# EAGLE design OSSIBeaconNewNew (EAGLE 6.1)

## Sheet 1 of 4
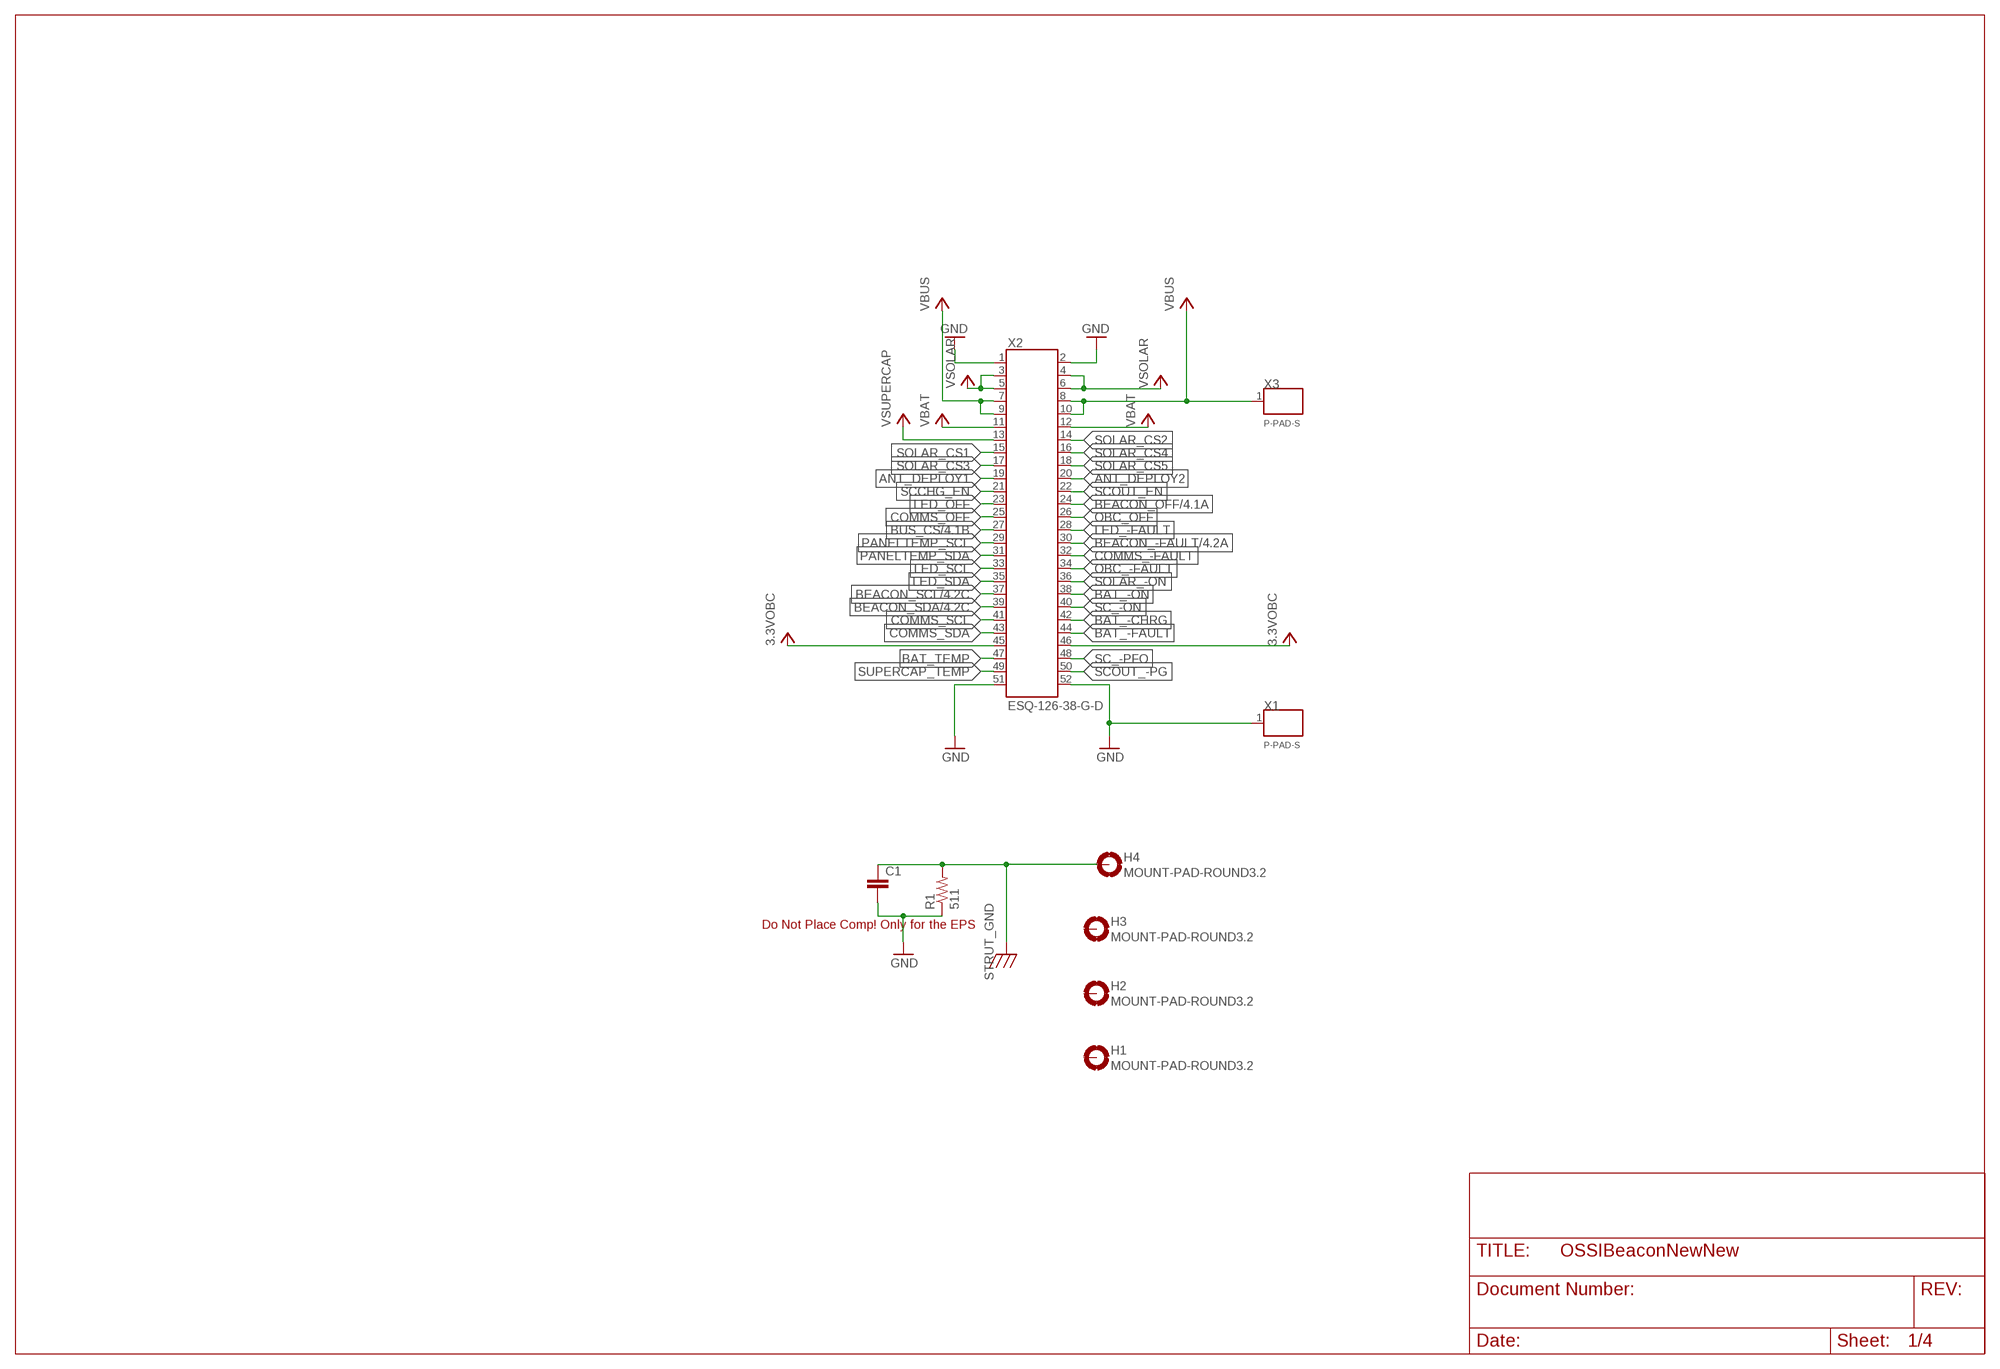
[diagram p0: schematic, sheet 1]

### Parts
C1  C0805(2012)  [C0805(2012)]
H1  MOUNT-PAD-ROUND3.2  [3.2-PAD-ROUND]
H2  MOUNT-PAD-ROUND3.2  [3.2-PAD-ROUND]
H3  MOUNT-PAD-ROUND3.2  [3.2-PAD-ROUND]
H4  MOUNT-PAD-ROUND3.2  [3.2-PAD-ROUND]
R1  511  RWSL1206  [WSL1206]
X1  P-PAD-S  [P-PAD-S]
X2  ESQ-126-38-G-D  [ESQ-126-XX-X-D]
X3  P-PAD-S  [P-PAD-S]

### Nets
3.3VOBC: X2.45 X2.46
ANT_DEPLOY1: X2.19
ANT_DEPLOY2: X2.20
BAT_-CHRG: X2.42
BAT_-FAULT: X2.44
BAT_-ON: X2.38
BAT_TEMP: X2.47
BEACON_-FAULT: X2.30 ; also sheet 4
BEACON_OFF: X2.24 ; also sheet 4
BEACON_SCL: X2.37 ; also sheet 4
BEACON_SDA: X2.39 ; also sheet 4
BUS_CS: X2.27 ; also sheet 4
COMMS_-FAULT: X2.32
COMMS_OFF: X2.25
COMMS_SCL: X2.41
COMMS_SDA: X2.43
GND: C1.2 R1.P$1 X1.1 X2.1 X2.2 X2.51 X2.52 ; also sheet 2,3,4
LED_-FAULT: X2.28
LED_OFF: X2.23
LED_SCL: X2.33
LED_SDA: X2.35
OBC_-FAULT: X2.34
OBC_OFF: X2.26
PANELTEMP_SCL: X2.29
PANELTEMP_SDA: X2.31
SC_-ON: X2.40
SC_-PFO: X2.48
SCCHG_EN: X2.21
SCOUT_-PG: X2.50
SCOUT_EN: X2.22
SOLAR_-ON: X2.36
SOLAR_CS1: X2.15
SOLAR_CS2: X2.14
SOLAR_CS3: X2.17
SOLAR_CS4: X2.16
SOLAR_CS5: X2.18
STRUT_GND: C1.1 H4.B3,2(MOUNT) R1.P$2
SUPERCAP_TEMP: X2.49
VBAT: X2.11 X2.12
VBUS: X2.7 X2.8 X2.9 X2.10 X3.1 ; also sheet 2,4
VSOLAR: X2.3 X2.4 X2.5 X2.6
VSUPERCAP: X2.13
Unconnected: H1.B3,2(MOUNT) H2.B3,2(MOUNT) H3.B3,2(MOUNT)

### Notes on the sheet
- Do Not Place Comp! Only for the EPS

## Sheet 2 of 4
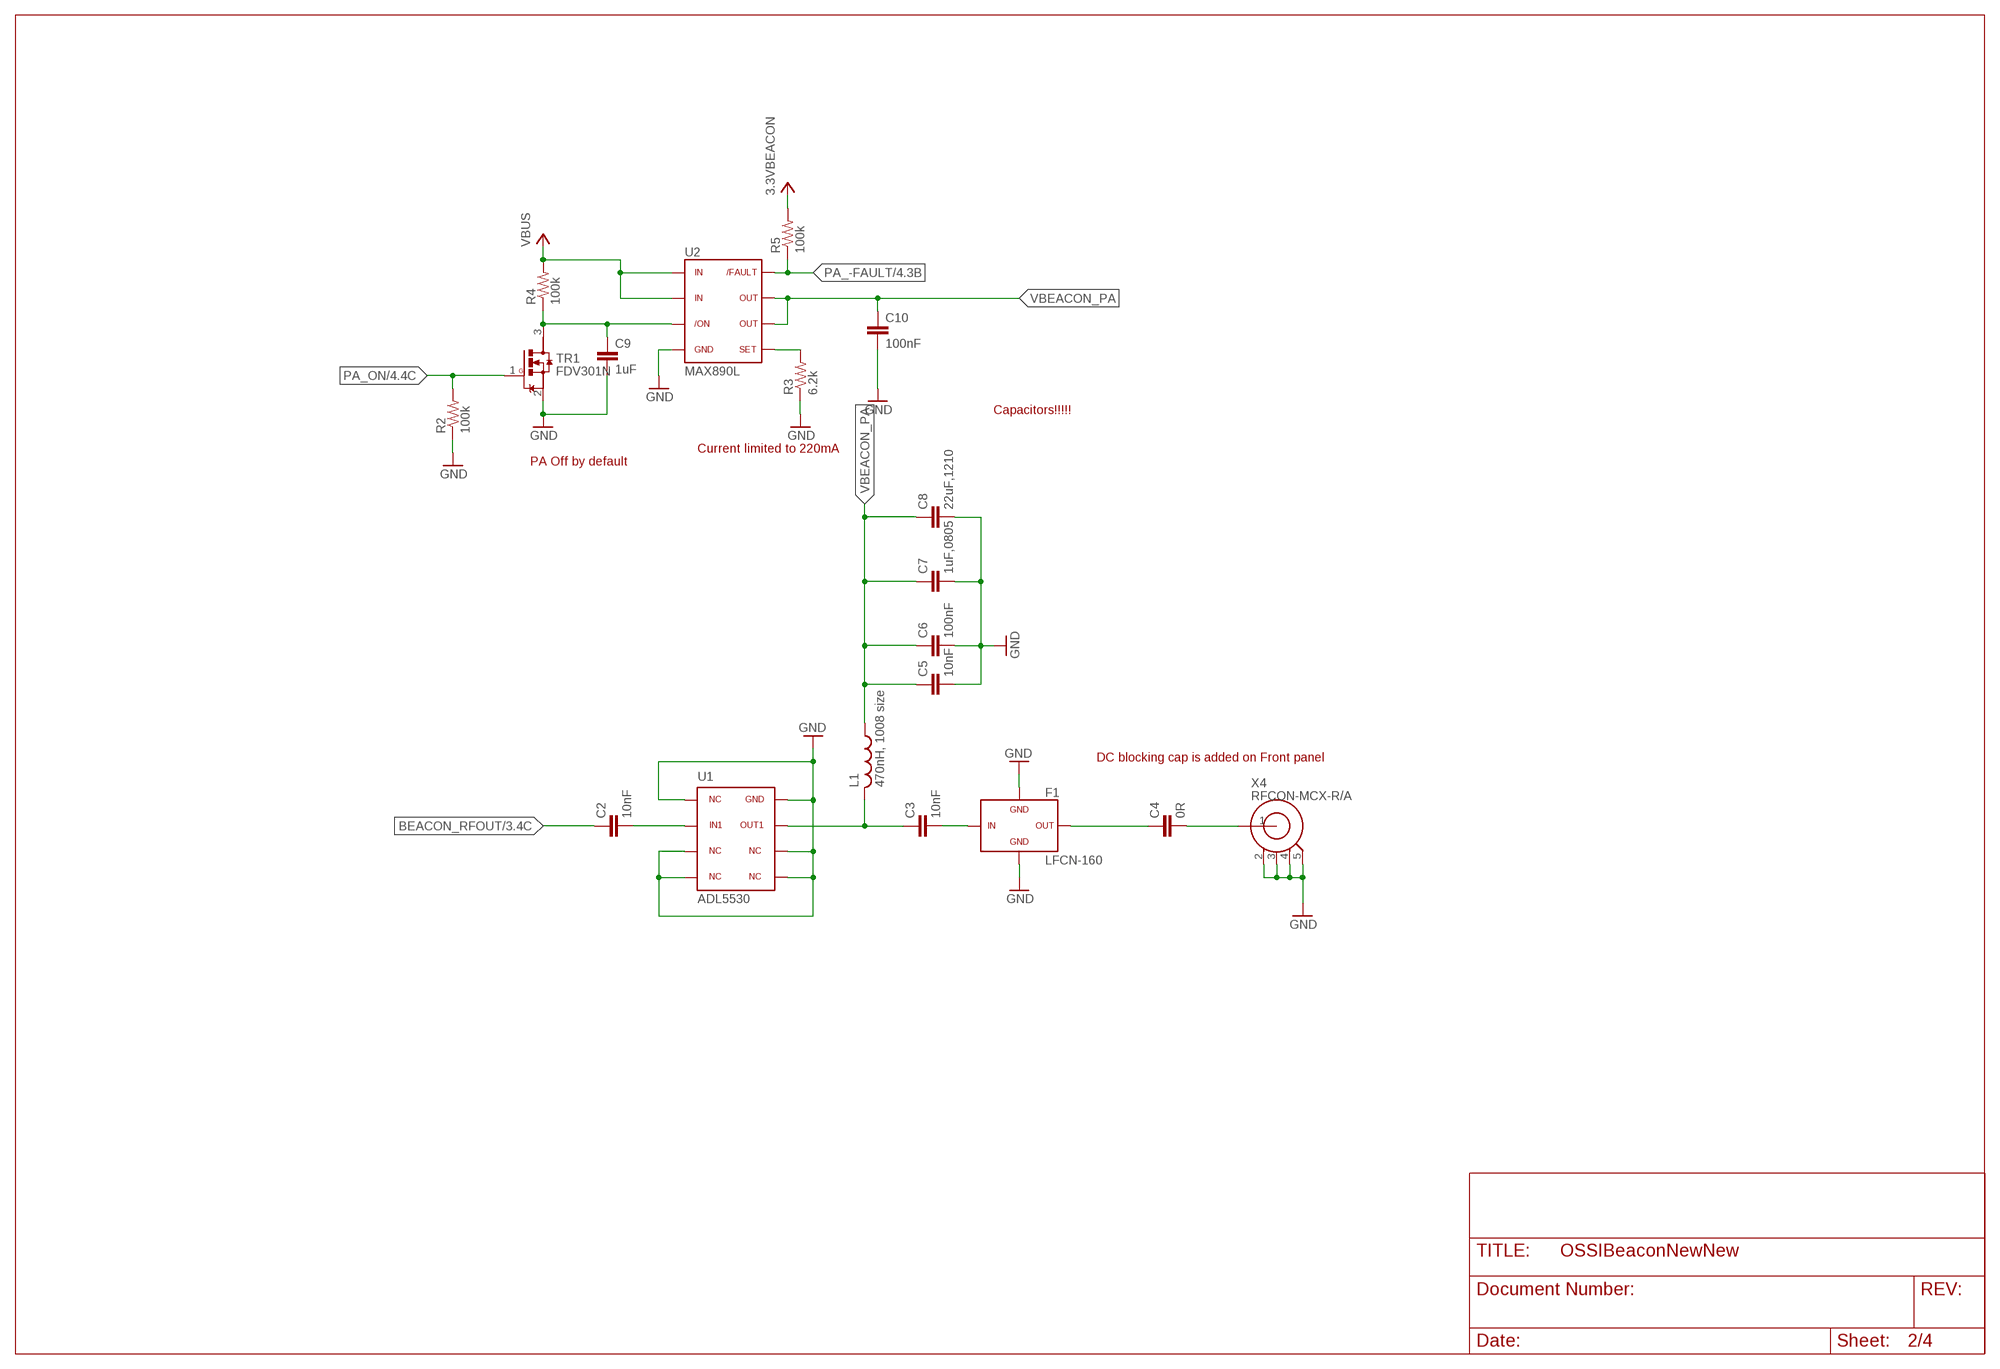
[diagram p1: schematic, sheet 2]

### Parts
C2  10nF  C0603(1608)  [C0603(1608)]
C3  10nF  C0603(1608)  [C0603(1608)]
C4  0R  C0603(1608)  [C0603(1608)]
C5  10nF  C0603(1608)  [C0603(1608)]
C6  100nF  C0603(1608)  [C0603(1608)]
C7  1uF,0805  C0805(2012)  [C0805(2012)]
C8  22uF,1210  C1210(3225)-GCM32  [C1210-GCM32]
C9  1uF  C0603(1608)  [C0603(1608)]
C10  100nF  C0603(1608)  [C0603(1608)]
F1  LFCN-160  [LFCN]
L1  470nH, 1008 size  L1008(2502)  [L1008(2520)]
R2  100k  R0603(1608)  [R0603(1608)]
R3  6.2k  R0603(1608)  [R0603(1608)]
R4  100k  R0603(1608)  [R0603(1608)]
R5  100k  R0603(1608)  [R0603(1608)]
TR1  FDV301N  [SOT23]
U1  ADL5530  [LFCSP8_CP]
U2  MAX890L  [SO8]
X4  RFCON-MCX-R/A  [MCX-R/A]

### Nets
3.3VBEACON: R5.2 ; also sheet 4
BEACON_RFOUT: C2.1 ; also sheet 3
GND: C5.2 C6.2 C7.2 C8.P$2 C9.2 C10.2 F1.2 F1.4 R2.1 R3.1 TR1.2(S) U1.1 U1.3 U1.4 U1.5 U1.6 U1.8 U2.4 X4.2 X4.3 X4.4 X4.5 ; also sheet 1,3,4
N$19: C9.1 R4.1 TR1.3(D) U2.3
N$21: R3.2 U2.5
N$28: C2.2 U1.2
N$30: C3.1 L1.P$2 U1.7
N$34: C3.2 F1.1
N$35: C4.1 F1.3
N$37: C4.2 X4.1
PA_-FAULT: R5.1 U2.8 ; also sheet 4
PA_ON: R2.2 TR1.1(G) ; also sheet 4
VBEACON_PA: C5.1 C6.1 C7.1 C8.P$1 C10.1 L1.P$1 U2.6 U2.7
VBUS: R4.2 U2.1 U2.2 ; also sheet 1,4

### Notes on the sheet
- Capacitors!!!!!
- Current limited to 220mA
- PA Off by default
- DC blocking cap is added on Front panel

## Sheet 3 of 4
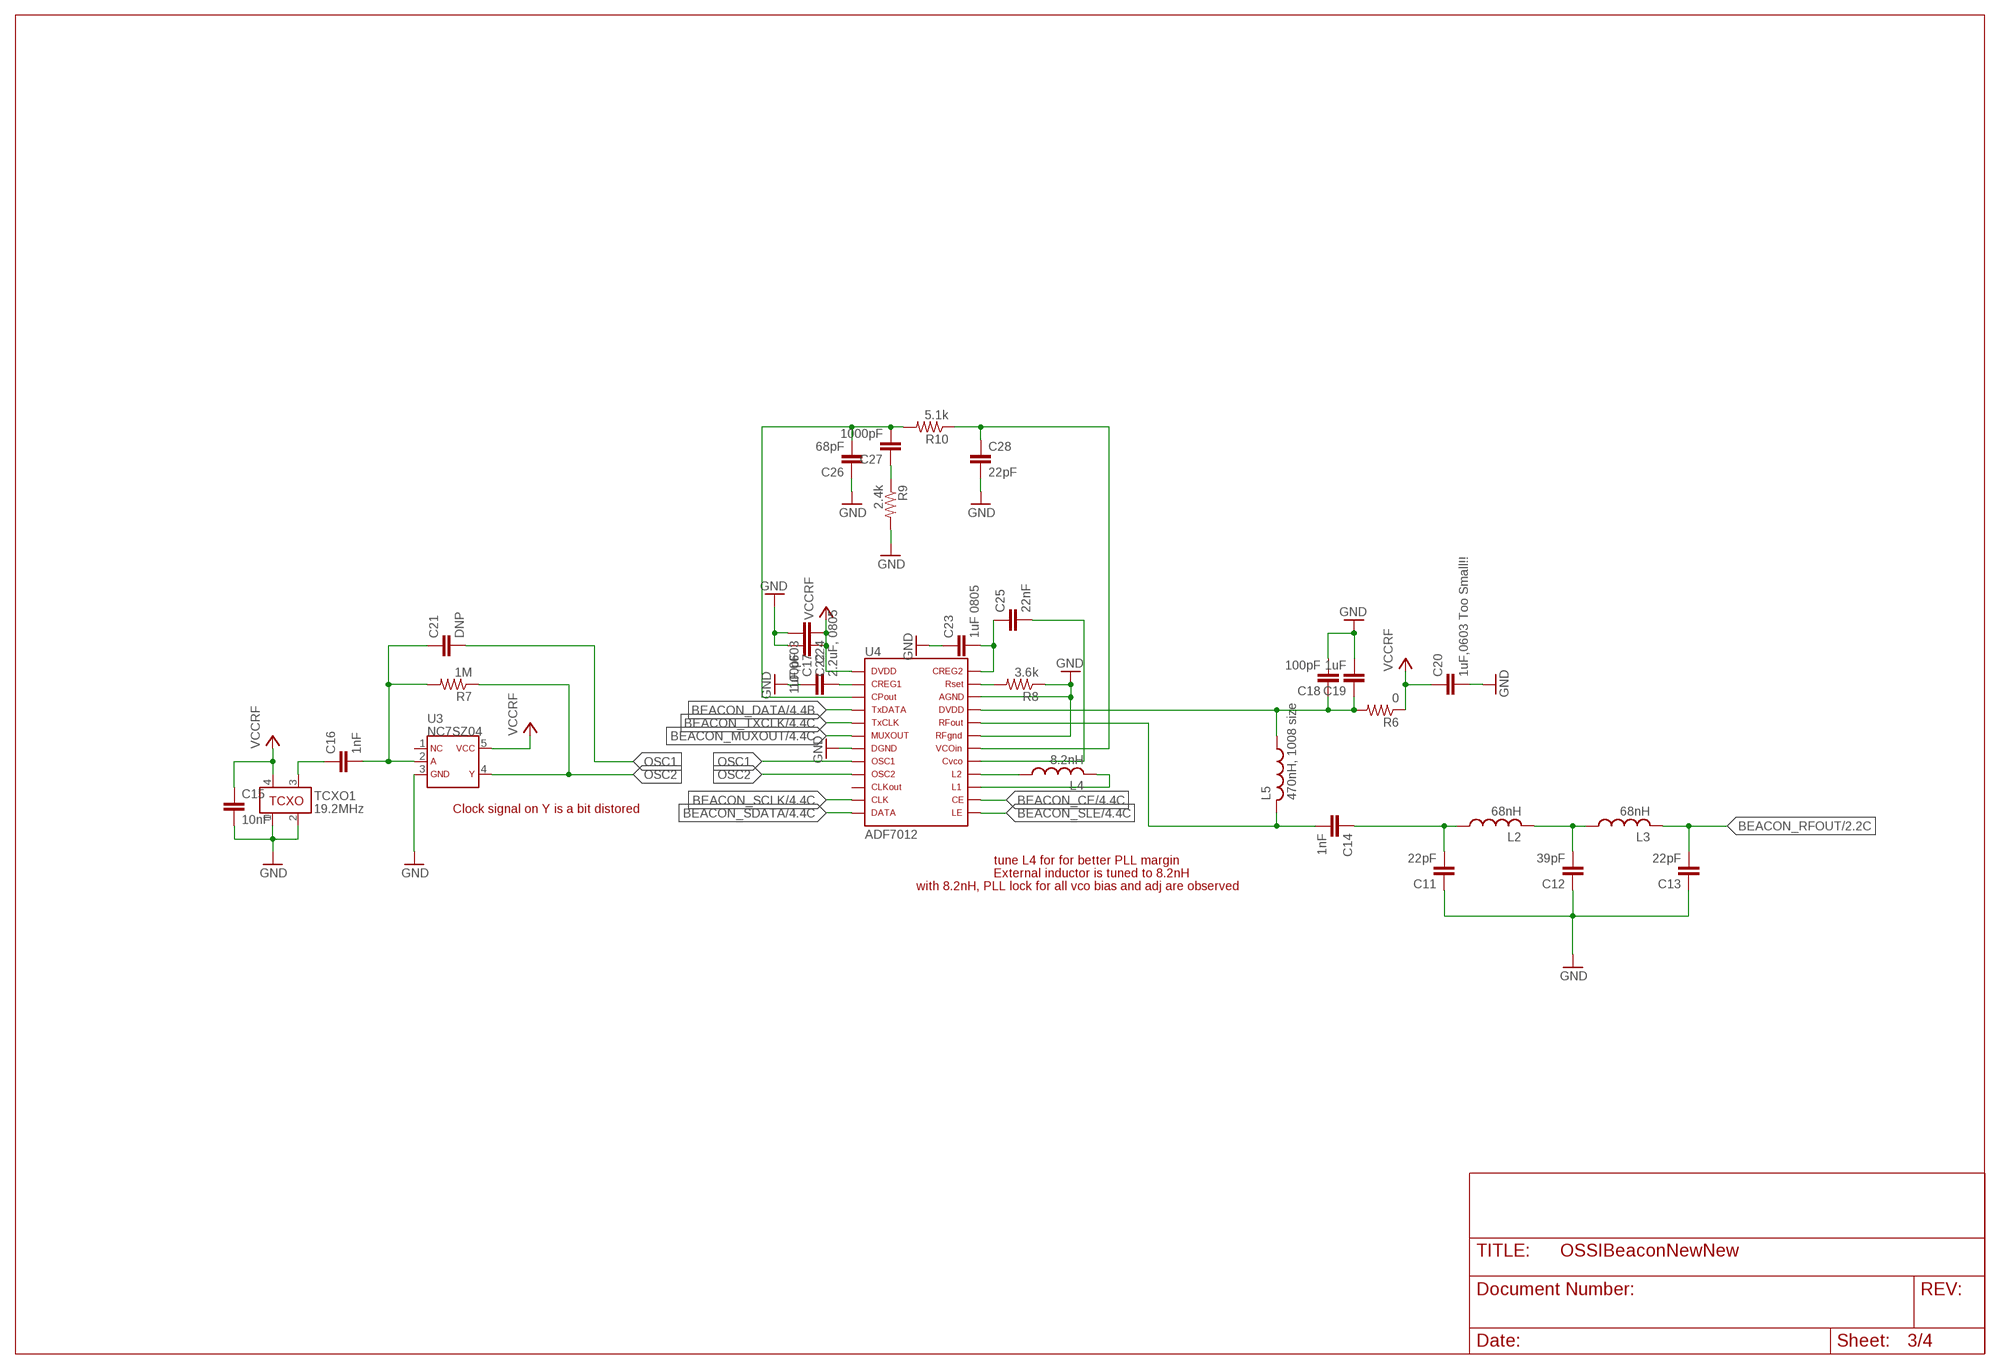
[diagram p2: schematic, sheet 3]

### Parts
C11  22pF  C0603(1608)  [C0603(1608)]
C12  39pF  C0603(1608)  [C0603(1608)]
C13  22pF  C0603(1608)  [C0603(1608)]
C14  1nF  C0603(1608)  [C0603(1608)]
C15  10nF  C0603(1608)  [C0603(1608)]
C16  1nF  C0603(1608)  [C0603(1608)]
C17  2.2uF, 0805  C0805(2012)  [C0805(2012)]
C18  100pF  C0603(1608)  [C0603(1608)]
C19  1uF  C0603(1608)  [C0603(1608)]
C20  1uF,0603 Too Small!!  C0603(1608)  [C0603(1608)]
C21  DNP  C0603(1608)  [C0603(1608)]
C22  100pF  C0603(1608)  [C0603(1608)]
C23  1uF 0805  C0805(2012)  [C0805(2012)]
C24  1uF,0603  C0603(1608)  [C0603(1608)]
C25  22nF  C0603(1608)  [C0603(1608)]
C26  68pF  C0603(1608)  [C0603(1608)]
C27  1000pF  C0603(1608)  [C0603(1608)]
C28  22pF  C0603(1608)  [C0603(1608)]
L2  68nH  L0603(1608)  [L0603(1608)]
L3  68nH  L0603(1608)  [L0603(1608)]
L4  8.2nH  L0603(1608)  [L0603(1608)]
L5  470nH, 1008 size  L1008(2502)  [L1008(2520)]
R6  0  R0603(1608)  [R0603(1608)]
R7  1M  R0603(1608)  [R0603(1608)]
R8  3.6k  R0603(1608)  [R0603(1608)]
R9  2.4k  R0603(1608)  [R0603(1608)]
R10  5.1k  R0603(1608)  [R0603(1608)]
TCXO1  19.2MHz  TCXO-M532  [TCXO_M532]
U3  NC7SZ04  [SC70-5]
U4  ADF7012  [TSSOP24]

### Nets
BEACON_CE: U4.14(CE) ; also sheet 4
BEACON_DATA: U4.4(TXDATA) ; also sheet 4
BEACON_MUXOUT: U4.6(MUXOUT) ; also sheet 4
BEACON_RFOUT: C13.2 L3.2 ; also sheet 2
BEACON_SCLK: U4.11(CLK) ; also sheet 4
BEACON_SDATA: U4.12(DATA) ; also sheet 4
BEACON_SLE: U4.13(LE) ; also sheet 4
BEACON_TXCLK: U4.5(TXCLK) ; also sheet 4
GND: C11.1 C12.1 C13.1 C15.2 C17.1 C18.2 C19.2 C20.2 C22.2 C23.1 C24.2 C26.1 C28.2 R8.1 R9.2 TCXO1.1 TCXO1.2 U3.3 U4.7(DGND) U4.19(RFGND) U4.22(AGND) ; also sheet 1,2,4
N$14: L4.1 U4.16(L2)
N$15: L4.2 U4.15(L1)
N$16: C23.2 C25.1 U4.24(CREG2)
N$17: C25.2 U4.17(CVCO)
N$18: R8.2 U4.23(RSET)
N$20: C27.1 R9.1
N$23: C14.2 L5.P$2 U4.20(RFOUT)
N$24: C28.1 R10.1 U4.18(VCOIN)
N$25: C17.2 U4.2(CREG1)
N$26: C26.2 C27.2 R10.2 U4.3(CPOUT)
N$27: C18.1 C19.1 L5.P$1 R6.2 U4.21(DVDD_2)
N$29: C11.2 C14.1 L2.1
N$36: C12.2 L2.2 L3.1
N$38: C16.2 C21.1 R7.2 U3.2
N$69: C16.1 TCXO1.3
OSC1: C21.2 U4.8(OSC1)
OSC2: R7.1 U3.4 U4.9(OSC2)
VCCRF: C15.1 C20.1 C22.1 C24.1 R6.1 TCXO1.4 U3.5 U4.1(DVDD_1) ; also sheet 4
Unconnected: U3.1 U4.10(CLKOUT)

### Notes on the sheet
- Clock signal on Y is a bit distored
- tune L4 for for better PLL margin
- External inductor is tuned to 8.2nH
- with 8.2nH, PLL lock for all vco bias and adj are observed

## Sheet 4 of 4
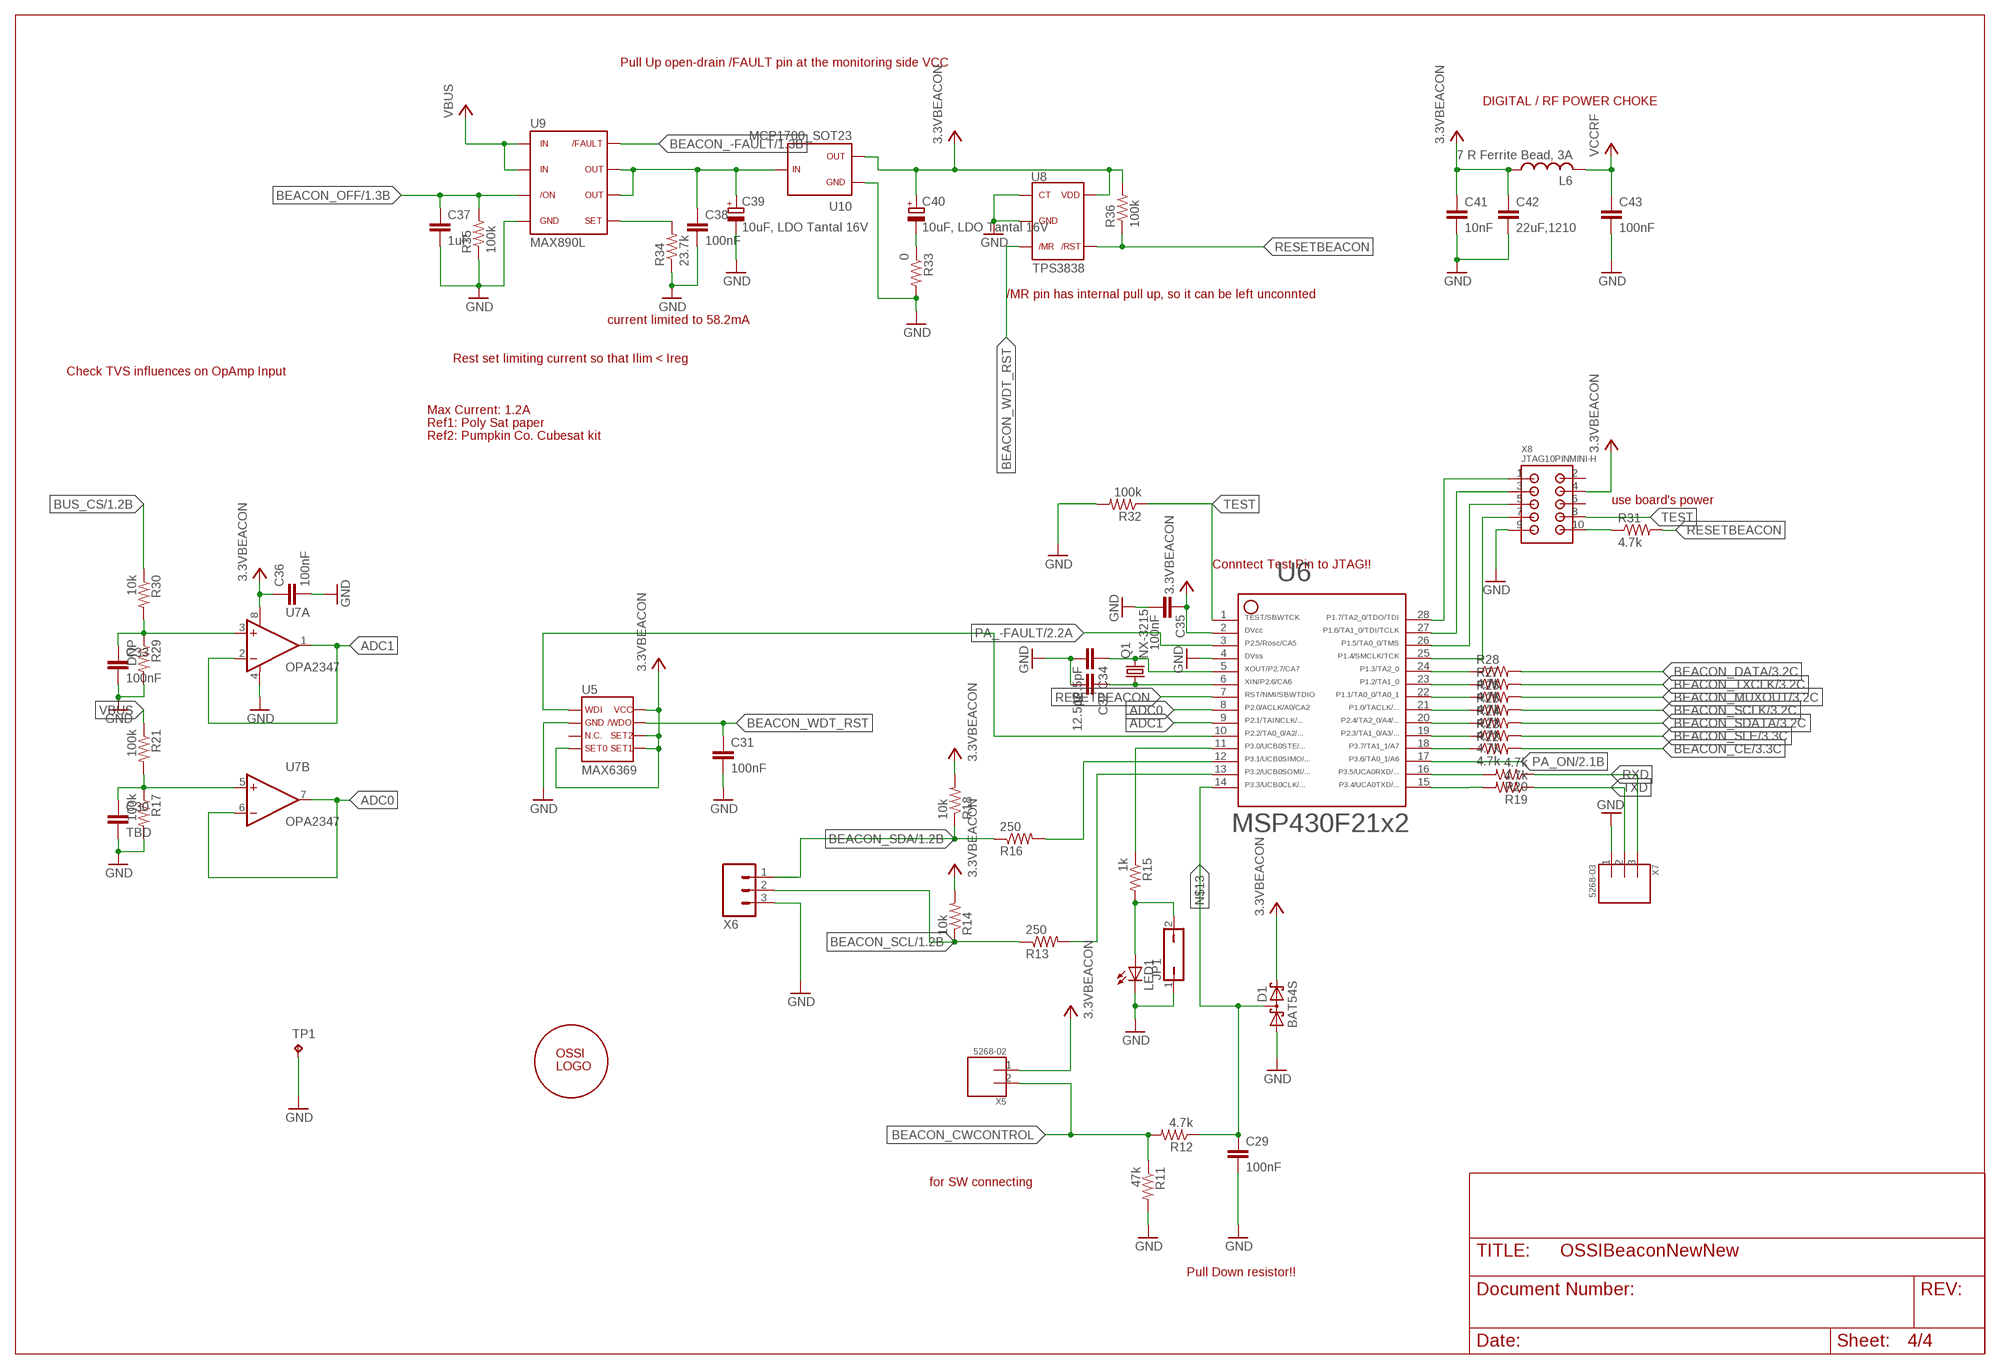
[diagram p3: schematic, sheet 4]

### Parts
C29  100nF  C0603(1608)  [C0603(1608)]
C30  TBD  C0603(1608)  [C0603(1608)]
C31  100nF  C0603(1608)  [C0603(1608)]
C32  12.5pF  C0603(1608)  [C0603(1608)]
C33  100nF  C0603(1608)  [C0603(1608)]
C34  12.5pF  C0603(1608)  [C0603(1608)]
C35  100nF  C0603(1608)  [C0603(1608)]
C36  100nF  C0603(1608)  [C0603(1608)]
C37  1uF  C0603(1608)  [C0603(1608)]
C38  100nF  C0603(1608)  [C0603(1608)]
C39  10uF, LDO Tantal 16V  C-TANTAL-A  [C1206(3216)-A]
C40  10uF, LDO Tantal 16V  C-TANTAL-A  [C1206(3216)-A]
C41  10nF  C0603(1608)  [C0603(1608)]
C42  22uF,1210  C1210(3225)-GCM32  [C1210-GCM32]
C43  100nF  C0603(1608)  [C0603(1608)]
D1  BAT54S  [SOT23]
JP1  JP1Q  [JP1]
L6  7 R Ferrite Bead, 3A  L0805(2012)  [L0805(2012)]
LED1  LED0603  [LED-0603]
Q1  NX-3215  [NX-3215]
R11  47k  R0603(1608)  [R0603(1608)]
R12  4.7k  R0603(1608)  [R0603(1608)]
R13  250  R0603(1608)  [R0603(1608)]
R14  10k  R0603(1608)  [R0603(1608)]
R15  1k  R0603(1608)  [R0603(1608)]
R16  250  R0603(1608)  [R0603(1608)]
R17  100k  R0603(1608)  [R0603(1608)]
R18  10k  R0603(1608)  [R0603(1608)]
R19  4.7k  R0603(1608)  [R0603(1608)]
R20  4.7k  R0603(1608)  [R0603(1608)]
R21  100k  R0603(1608)  [R0603(1608)]
R22  4.7k  R0603(1608)  [R0603(1608)]
R23  4.7k  R0603(1608)  [R0603(1608)]
R24  4.7k  R0603(1608)  [R0603(1608)]
R25  4.7k  R0603(1608)  [R0603(1608)]
R26  4.7k  R0603(1608)  [R0603(1608)]
R27  4.7k  R0603(1608)  [R0603(1608)]
R28  4.7k  R0603(1608)  [R0603(1608)]
R29  DNP  R0603(1608)  [R0603(1608)]
R30  10k  R0603(1608)  [R0603(1608)]
R31  4.7k  R0603(1608)  [R0603(1608)]
R32  100k  R0603(1608)  [R0603(1608)]
R33  0  R0603(1608)  [R0603(1608)]
R34  23.7k  R0603(1608)  [R0603(1608)]
R35  100k  R0603(1608)  [R0603(1608)]
R36  100k  R0603(1608)  [R0603(1608)]
TP1  TP  [TP-13]
U5  MAX6369  [SOT23-8]
U6  MSP430F2132  [PW28]
U7  OPA2347  [SOT23-8DCN]
U8  TPS3838  [SOT23-5DBV]
U9  MAX890L  [SO8]
U10  MCP1700_SOT23  [SOT23]
U$1  OSSILOGORECT  [OSSILOGORECT1005]
X5  5268-02  [5628-02]
X6  M03PTH  [1X03]
X7  5268-03  [5268-03]
X8  JTAG10PINMINI-H  [M50-3200545]

### Nets
3.3VBEACON: C35.1 C36.1 C40.1(+) C41.1 C42.P$1 D1.2(C2) L6.1 R14.2 R18.2 R36.2 U5.4 U5.5 U5.6 U5.8 U6.2 U7.8(A:V+) U8.5 U10.2 X5.1 X8.4 ; also sheet 2
ADC0: U6.8 U7.6(B:-IN) U7.7(B:OUT)
ADC1: U6.9 U7.1(A:OUT) U7.2(A:-IN)
BEACON_-FAULT: U9.8 ; also sheet 1
BEACON_CE: R22.2 ; also sheet 3
BEACON_CWCONTROL: R11.1 R12.2 X5.2
BEACON_DATA: R28.2 ; also sheet 3
BEACON_MUXOUT: R26.2 ; also sheet 3
BEACON_OFF: C37.1 R35.2 U9.3 ; also sheet 1
BEACON_SCL: R13.1 R14.1 X6.2 ; also sheet 1
BEACON_SCLK: R25.2 ; also sheet 3
BEACON_SDA: R16.1 R18.1 X6.1 ; also sheet 1
BEACON_SDATA: R24.2 ; also sheet 3
BEACON_SLE: R23.2 ; also sheet 3
BEACON_TXCLK: R27.2 ; also sheet 3
BEACON_WDT_RST: C31.1 U5.7 U8.3
BUS_CS: R30.1 ; also sheet 1
GND: C29.2 C30.2 C31.2 C32.2 C33.2 C34.2 C35.2 C36.2 C37.2 C38.2 C39.2(-) C41.2 C42.P$2 C43.2 D1.1(A1) JP1.1 LED1.C R11.2 R17.2 R29.2 R32.2 R33.2 R34.1 R35.1 TP1.TP U5.2 U6.4 U7.4(A:V-) U8.1 U8.2 U9.4 U10.1 X6.3 X7.1 X8.9 ; also sheet 1,2,3
N$1: R15.1 U6.11
N$2: U6.27 X8.3
N$3: U6.26 X8.5
N$4: U6.25 X8.7
N$5: C34.1 Q1.2 U6.5
N$6: C32.1 Q1.1 U6.6
N$7: JP1.2 LED1.A R15.2
N$8: U6.28 X8.1
N$9: R16.2 U6.12
N$10: R13.2 U6.13
N$11: R20.2 U6.16
N$12: U5.1 U6.10
N$13: C29.1 D1.3(C1A2) R12.1 U6.14
N$22: C30.1 R17.1 R21.2 U7.5(B:+IN)
N$31: R31.1 X8.10
N$32: R34.2 U9.5
N$33: C33.1 R29.1 R30.2 U7.3(A:+IN)
N$39: R19.2 U6.15
N$40: C40.2(-) R33.1
N$41: R28.1 U6.24
N$42: R27.1 U6.23
N$43: R26.1 U6.22
N$44: R25.1 U6.21
N$45: R24.1 U6.20
N$46: R23.1 U6.19
N$47: R22.1 U6.18
N$666: C38.1 C39.1(+) U9.6 U9.7 U10.3
PA_-FAULT: U6.3 ; also sheet 2
PA_ON: U6.17 ; also sheet 2
RESETBEACON: R31.2 R36.1 U6.7 U8.4
RXD: R20.1 X7.3
TEST: R32.1 U6.1 X8.8
TXD: R19.1 X7.2
VBUS: R21.1 U9.1 U9.2 ; also sheet 1,2
VCCRF: C43.1 L6.2 ; also sheet 3
Unconnected: U5.3 X8.2 X8.6

### Notes on the sheet
- Pull Up open-drain /FAULT pin at the monitoring side VCC
- DIGITAL / RF POWER CHOKE
- /MR pin has internal pull up, so it can be left unconnted
- current limited to 58.2mA
- Rest set limiting current so that Ilim < Ireg
- Check TVS influences on OpAmp Input
- Max Current: 1.2A
- Ref1: Poly Sat paper
- Ref2: Pumpkin Co. Cubesat kit
- use board's power
- Conntect Test Pin to JTAG!!
- for SW connecting
- Pull Down resistor!!

## Library data of the parts
C1-C38 C41-C43 = OSSI:C
C39 C40 = OSSI:C-TANTAL-A: TAJA105M020RNJ Tantal Capacitor Manufacturer: AVX 1206(3126) Ref: www.avx.com/docs/techinfo/tantappl.pdf
D1 = OSSI:BAT54S: Schottky Diodes Pin connection corrected 2011-05-04 Source: Fairchild .. BAT54.pdf
F1 = OSSI:LFCN-160: LFCN-160 Low Pass Filter DC - 160MHz Low Pass Filter Cut Off Freq: 230MHz 8W power rating ( degraded to 3W at 100 celcius degree)
H1-H4 = OSSI:MOUNT-PAD-ROUND
JP1 = OSSI:JP1Q: JUMPER
L1-L6 = OSSI:L
LED1 = SparkFun:LED: LEDs Standard schematic elements and footprints for 5mm, 3mm, 1206, and 0603 sized LEDs. 5mm - Spark Fun Electronics SKU : COM-00529 (and others)
Q1 = OSSI:NX-3215: NDK 32.768 kHz SMD Crystal P/N: NX3215SA-32.768K-STD-MUA-9 Nominal frequency (kHz): 32.768 Package Size (L×W×H : mm): 3.2×1.5×0.8 Operating Temperature Range(*1) / Storage Temperature Range (°C): -40 to +85 / -40 to +85 Level of drive: 0.1µW (Max. 0.5µW) Frequency Tolerance (25±3°C): ±20×10-6 Load Capacitance: 9.0pF, 12.5pF Equivalent Series Resistance: 70kΩ Max. Ordering Code: NX3215SA-32.768K-STD-MUA-9 (Load Capacitance9.0pF) /NX3215SA-32.768K-STD-MUA-8 (Load Capacitance12.5pF)
R1-R36 = OSSI:R
TCXO1 = OSSI:TCXO-M532: 532L25DT19M2000: CTO electronic components Model 532 19.2MHz TCXO for RF transeiver Clipped Sine Wave Output Operating Voltage, +3.3Vdc Operating Temperature to -30°C to +85°C Frequency Stability: ±2.5ppm
TP1 = OSSI:TP
TR1 = OSSI:FDV301N: FDV301N Digital N channel - FET / Rdson = 5 Ohm / Vgs = 0.7~1.06V / Ids = 220mA
U1 = OSSI:ADL5530: ADL5530 IF Gain Block Fixed gain: 16.dB Operation: 0~1000Mhz Internally matched input and output to 50 Ω Power supply: 3V or 5V 110 mA power supply current
U2 U9 = OSSI:MAX890L: MAX 890L 1.2A, Current-Limited, High-Side P-Channel Switch with Thermal Shutdown BY MAXIM
U3 = OSSI:NC7SZ04: UHS Inverter NC7SZ04
U4 = OSSI:ADF7012
U5 = OSSI:MAX6369: MAX6369 Pin-Selectable Watchdog Timers Max 6369 is Open-drain output 1 ms to 60 s seletable timeout
U6 = OSSI:MSP430F2132: *** MSP430F21x2 *** PW28
U7 = OSSI:OPA2347: OPA2347 RAIL-TO-RAIL INPUT AND OUTPUT SINGLE SUPPLY: 2.3V to 5.5V LOW IQ: 20µ
U8 = OSSI:TPS3838: TPS3838 NanoPower Supervisory IC from texas instruments. TPS3838 is open-drain output
U10 = OSSI:MCP1700: MCP1700 LDO from Microchips
U$1 = OSSI:OSSILOGO
X1 X3 = OSSI:P-PAD
X2 = OSSI:ESQ-126-: Samtec ESQ-126-XX-G-D Elevated Sockets Seires ESQ-126-37-G-D ESQ-126-38-G-D ESQ-126-39-G-D
X4 = OSSI:RFCON: RF Connectors
X5 = OSSI:5268-02
X6 = OSSI:M03: Header 3 Standard 3-pin 0.1" header. Use with straight break away headers (SKU : PRT-00116), right angle break away headers (PRT-00553), swiss pins (PRT-00743), machine pins (PRT-00117), and female headers (PRT-00115). Molex polarized connector foot print use with SKU : PRT-08232 with associated crimp pins and housings.
X7 = OSSI:5268-03
X8 = OSSI:JTAG10PINMINI

## Board
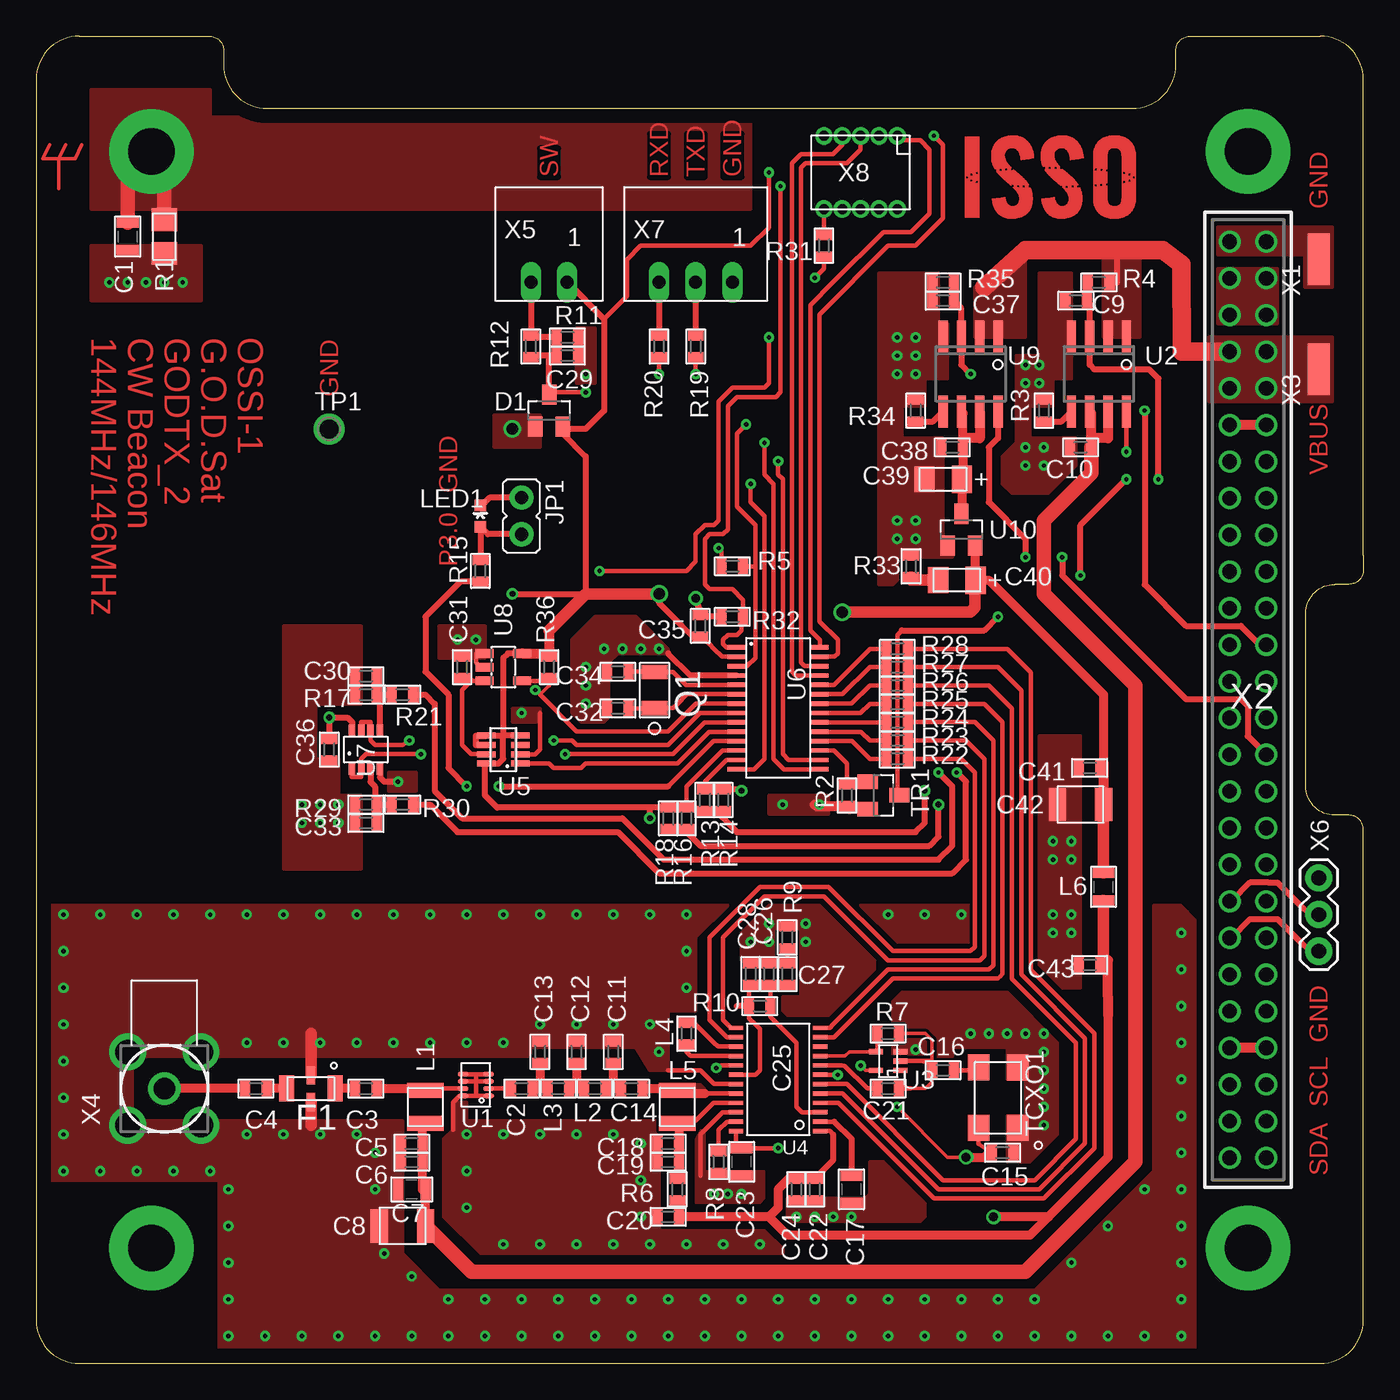
[diagram p4: board, top side]
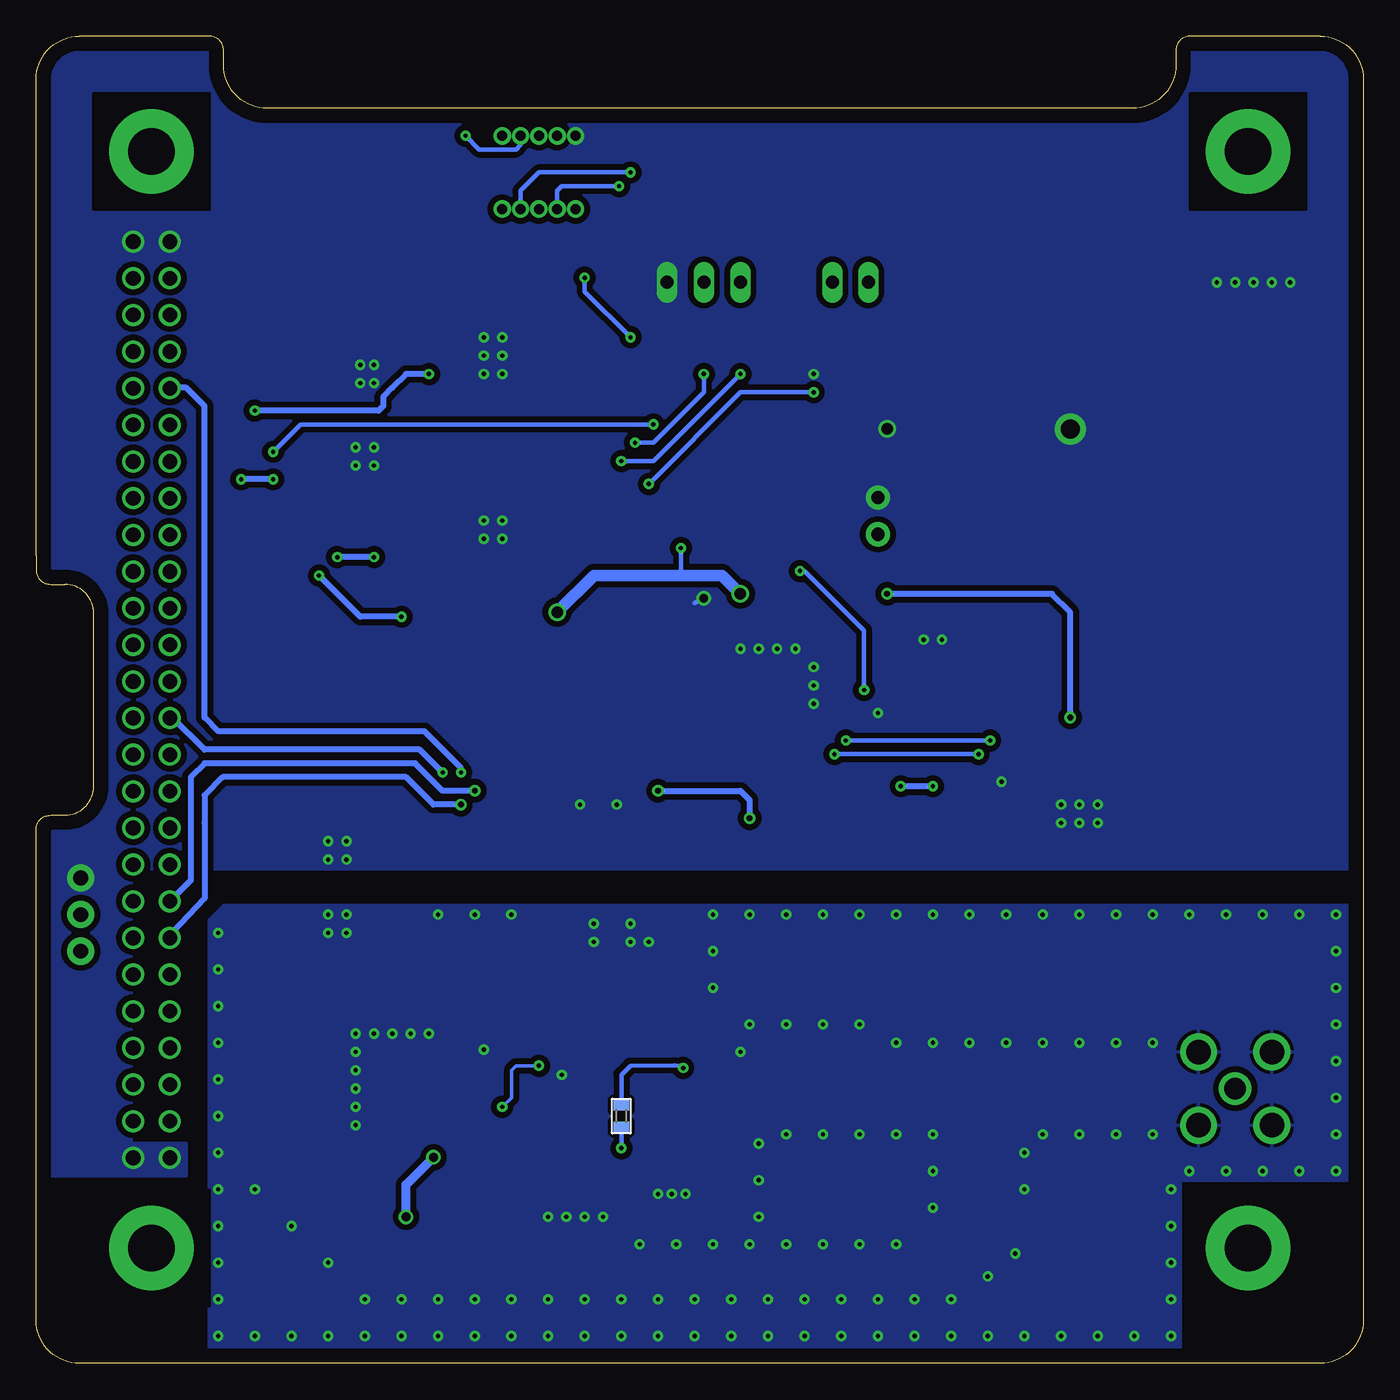
[diagram p5: board, bottom side, seen from below]

Size 92 x 92 mm. Coordinates in mm from the lower left corner, seen from the top.
Outline: 0,89 0,3 arc90 3,0 89,0 arc90 92,3 92,36 92,37 arc90 91,38 90,38 arc-90 88,40 88,52 arc-90 90,54 91,54 arc90 92,55 92,56 92,89 arc90 89,92 80,92 arc90 79,91 79,90 arc-90 76,87 16,87 arc-90 13,90 13,91 arc90 12,92 3,92 arc90 0,89
Copper layers (1*16): Top 0.035mm / dielectric 1.5mm / Bottom 0.035mm
Design rules: minimum track width 10mil, minimum drill 24mil, track to track 8mil, track to pad 8mil, pad to pad 8mil, via to via 8mil, smd to smd 8mil, copper to edge 40mil, drill to drill 8mil, minimum pad ring 10mil, minimum via ring 8mil, stop-mask expansion 4mil, vias tented up to drill 0mil, thermal gap 10mil

### Footprints (pad centres in the part's own frame; a part is rotated, then mirrored left to right if it is on the bottom)
C0805(2012) = smd 0.7 x 1.5: 1 -0.95,0; 2 0.95,0
C0603(1608) = smd 0.7 x 1.1: 1 -0.75,0; 2 0.75,0
C1210-GCM32 = smd 1.2 x 2.3: P$1 -1.6,0; P$2 1.6,0
C1206(3216)-A = smd 1.4 x 1.9: 1 -1.3,0 | smd 1.4 x 1.8: 2 1.3,0
SOT23 = smd 1 x 1.4: 1 -0.95,-1.1; 2 0.95,-1.1; 3 0,1.1
LFCN = smd 1.045 x 1.8: 1 -1.675,0; 3 1.675,0 | smd 0.61 x 1.25: 2 0,-0.925; 4 0,0.925
3.2-PAD-ROUND = drill 3.2 pad 5.842: B3,2 0,0
JP1 = drill 0.914 pad 1.676: 1 0,-1.27; 2 0,1.27
L1008(2520) = smd 2.54 x 1.02: P$1 0,1.145; P$2 0,-1.145
L0603(1608) = smd 0.7 x 1.1: 1 -0.75,0; 2 0.75,0
L0805(2012) = smd 0.7 x 1.5: 1 -0.95,0; 2 0.95,0
LED-0603 = smd 0.8 x 0.8: A 0,-0.75; C 0,0.75
NX-3215 = smd 1 x 1.8: 1 -1.25,0; 2 1.25,0
WSL1206 = smd 1.57 x 1.78: P$1 -1.165,0; P$2 1.165,0
R0603(1608) = smd 0.7 x 1.1: 1 -0.75,0; 2 0.75,0
TCXO_M532 = smd 1.8 x 1.5: 1 -2.1,-1.35; 2 2.1,-1.35; 3 2.1,1.35; 4 -2.1,1.35
TP-13 = drill 1.321 pad 2.159: TP 0,0
LFCSP8_CP = smd 0.7 x 0.33: 1 -0.885,0.75; 2 -0.885,0.25; 3 -0.885,-0.25; 4 -0.885,-0.75; 5 0.885,-0.75; 6 0.885,-0.25; 7 0.885,0.25; 8 0.885,0.75
SO8 = smd 0.65 x 2.2: 1 -1.905,-2.6; 2 -0.635,-2.6; 3 0.635,-2.6; 4 1.905,-2.6; 5 1.905,2.6; 6 0.635,2.6; 7 -0.635,2.6; 8 -1.905,2.6
SC70-5 = smd 0.36 x 0.95: 1 -0.65,-0.85; 2 0,-0.85; 3 0.65,-0.85; 4 0.65,0.85; 5 -0.65,0.85
TSSOP24 = smd 0.305 x 0.991: 1 -3.575,-2.918; 2 -2.925,-2.918; 3 -2.275,-2.918; 4 -1.625,-2.918; 5 -0.975,-2.918; 6 -0.325,-2.918; 7 0.325,-2.918; 8 0.975,-2.918; 9 1.625,-2.918; 10 2.275,-2.918; 11 2.925,-2.918; 12 3.575,-2.918; 13 3.575,2.918; 14 2.925,2.918; 15 2.275,2.918; 16 1.625,2.918; 17 0.975,2.918; 18 0.325,2.918; 19 -0.325,2.918; 20 -0.975,2.918; 21 -1.625,2.918; 22 -2.275,2.918; 23 -2.925,2.918; 24 -3.575,2.918
SOT23-8 = smd 0.42 x 1.3: 1 -0.975,-1.175; 2 -0.325,-1.175; 3 0.325,-1.175; 4 0.975,-1.175; 5 0.975,1.175; 6 0.325,1.175; 7 -0.325,1.175; 8 -0.975,1.175
PW28 = smd 0.3 x 1.2: 1 -4.229,-2.908; 2 -3.579,-2.908; 3 -2.929,-2.908; 4 -2.279,-2.908; 5 -1.629,-2.908; 6 -0.979,-2.908; 7 -0.329,-2.908; 8 0.321,-2.908; 9 0.971,-2.908; 10 1.621,-2.908; 11 2.271,-2.908; 12 2.921,-2.908; 13 3.571,-2.908; 14 4.221,-2.908; 15 4.221,2.892; 16 3.571,2.892; 17 2.921,2.892; 18 2.271,2.892; 19 1.621,2.892; 20 0.971,2.892; 21 0.321,2.892; 22 -0.329,2.892; 23 -0.979,2.892; 24 -1.629,2.892; 25 -2.279,2.892; 26 -2.929,2.892; 27 -3.579,2.892; 28 -4.229,2.892
SOT23-8DCN = smd 0.45 x 0.8: 1 -0.975,-1.35; 2 -0.325,-1.35; 3 0.325,-1.35; 4 0.975,-1.35; 5 0.975,1.35; 6 0.325,1.35; 7 -0.325,1.35; 8 -0.975,1.35
SOT23-5DBV = smd 0.6 x 1.22: 1 -0.95,-1.3; 2 0,-1.3; 3 0.95,-1.3; 4 0.95,1.3; 5 -0.95,1.3
P-PAD-S = smd 3.556 x 1.5: 1 0,0
ESQ-126-XX-X-D = drill 1.016 pad 1.524: 1 -1.27,31.75; 2 1.27,31.75; 3 -1.27,29.21; 4 1.27,29.21; 5 -1.27,26.67; 6 1.27,26.67; 7 -1.27,24.13; 8 1.27,24.13; 9 -1.27,21.59; 10 1.27,21.59; 11 -1.27,19.05; 12 1.27,19.05; 13 -1.27,16.51; 14 1.27,16.51; 15 -1.27,13.97; 16 1.27,13.97; 17 -1.27,11.43; 18 1.27,11.43; 19 -1.27,8.89; 20 1.27,8.89; 21 -1.27,6.35; 22 1.27,6.35; 23 -1.27,3.81; 24 1.27,3.81; 25 -1.27,1.27; 26 1.27,1.27; 27 -1.27,-1.27; 28 1.27,-1.27; 29 -1.27,-3.81; 30 1.27,-3.81; 31 -1.27,-6.35; 32 1.27,-6.35; 33 -1.27,-8.89; 34 1.27,-8.89; 35 -1.27,-11.43; 36 1.27,-11.43; 37 -1.27,-13.97; 38 1.27,-13.97; 39 -1.27,-16.51; 40 1.27,-16.51; 41 -1.27,-19.05; 42 1.27,-19.05; 43 -1.27,-21.59; 44 1.27,-21.59; 45 -1.27,-24.13; 46 1.27,-24.13; 47 -1.27,-26.67; 48 1.27,-26.67; 49 -1.27,-29.21; 50 1.27,-29.21; 51 -1.27,-31.75; 52 1.27,-31.75
MCX-R/A = drill 1.5: 1 0,0 | drill 1.7: 2 -2.54,2.54; 3 2.54,2.54; 4 2.54,-2.54; 5 -2.54,-2.54
5628-02 = drill 0.9 long: 1 1.25,0; 2 -1.25,0
1X03 = drill 1.016 pad 1.88: 1 0,0; 2 2.54,0; 3 5.08,0
5268-03 = drill 0.9 long: 1 2.54,0; 2 0,0; 3 -2.54,0
M50-3200545 = drill 0.7 pad 1: 1 -2.54,-2.54; 2 -2.54,2.54; 3 -1.27,-2.54; 4 -1.27,2.54; 5 0,-2.54; 6 0,2.54; 7 1.27,-2.54; 8 1.27,2.54; 9 2.54,-2.54; 10 2.54,2.54

### Placement (x,y rotation side)
C1  6.35,78.11 270 top
C2  33.66,19.05 180 top
C3  22.86,19.05 180 top
C4  15.24,19.05 180 top
C5  26.04,15.24 180 top
C6  26.04,13.97 180 top
C7  26.04,12.06 180 top
C8  25.4,9.53 180 top
C9  72.07,73.66 180 top
C10  72.39,63.5 180 top
C11  40.01,21.59 270 top
C12  37.47,21.59 270 top
C13  34.92,21.59 270 top
C14  41.27,19.05 0 top
C15  66.99,14.61 0 top
C16  62.87,20.32 180 top
C17  56.52,12.06 90 top
C18  43.81,15.24 180 top
C19  43.81,13.97 180 top
C20  43.81,10.16 180 top
C21  59.05,19.05 180 top
C22  53.98,12.06 270 top
C23  48.9,13.97 90 top
C24  52.7,12.06 270 top
C25  51.44,17.14 90 bottom
C26  50.8,26.99 270 top
C27  52.07,26.99 270 top
C28  49.53,26.99 90 top
C29  36.83,69.85 0 top
C30  22.86,47.62 180 top
C31  29.53,48.26 90 top
C32  40.32,45.4 180 top
C33  22.86,37.47 180 top
C34  40.32,47.94 180 top
C35  46.04,51.12 90 top
C36  20.32,42.55 270 top
C37  62.87,74.93 180 top
C38  63.5,63.5 180 top
C39  62.87,61.28 180 top
C40  63.82,54.29 180 top
C41  73.03,41.27 180 top
C42  72.39,38.73 180 top
C43  73.03,27.62 180 top
D1  35.56,66.04 0 top
F1  19.05,19.05 180 top
H1  8,8 0 top
H2  84,8 0 top
H3  84,84 0 top
H4  8,84 0 top
JP1  33.66,58.74 180 top
L1  26.99,17.78 180 top
L2  38.73,19.05 180 top
L3  36.2,19.05 180 top
L4  45.09,22.86 90 top
L5  44.45,17.78 180 top
L6  73.98,33.04 270 top
LED1  30.8,58.74 0 top
Q1  42.86,46.67 90 top
R1  8.89,78.11 90 top
R2  56.2,39.37 90 top
R3  69.85,66.04 270 top
R4  73.66,74.93 0 top
R5  48.26,55.24 180 top
R6  44.45,12.06 90 top
R7  59.05,22.86 0 top
R8  47.31,13.97 90 top
R9  52.07,29.53 90 top
R10  50.16,24.77 0 top
R11  36.83,71.12 0 top
R12  34.29,70.48 90 top
R13  46.35,39.05 90 top
R14  47.62,39.05 90 top
R15  30.8,54.93 90 top
R16  45.09,37.78 90 top
R17  22.86,46.35 180 top
R18  43.81,37.78 90 top
R19  45.72,70.48 270 top
R20  43.18,70.48 270 top
R21  25.4,46.35 180 top
R22  59.69,41.91 0 top
R23  59.69,43.18 0 top
R24  59.69,44.45 0 top
R25  59.69,45.72 0 top
R26  59.69,46.99 0 top
R27  59.69,48.26 0 top
R28  59.69,49.53 0 top
R29  22.86,38.73 180 top
R30  25.4,38.73 180 top
R31  54.61,77.47 270 top
R32  48.26,51.75 180 top
R33  60.64,55.24 90 top
R34  60.96,66.04 270 top
R35  62.87,73.66 0 top
R36  35.56,48.26 90 top
TCXO1  66.67,18.41 90 top
TP1  20.32,64.77 0 top
TR1  58.74,39.37 270 top
U1  30.48,19.3 180 top
U2  73.66,68.58 180 top
U3  59.05,20.95 90 top
U4  51.44,19.68 90 top
U5  32.38,42.55 90 top
U6  51.44,45.4 270 top
U7  22.86,42.55 0 top
U8  32.38,48.26 270 top
U9  64.77,68.58 180 top
U10  64.14,57.78 0 top
U$1  76.2,85.09 180 top
X1  88.9,76.52 90 top
X2  84,46 0 top
X3  88.9,68.9 90 top
X4  8.89,19.05 90 top
X5  35.56,74.93 0 top
X6  88.9,28.57 90 top
X7  45.72,74.93 0 top
X8  57.15,82.55 180 top

### Tracks (layer width: path | path; a pad name or v marks a point on that pad's centre or on a via)
3.3VBEACON  (via drill 0.3, 0.4, 0.8)
  Top 0.254: C41.1 73.98,41.27
  Top 0.305: U6.2 47.54,48.98 46.99,49.53 46.67,49.85 C35.1 | R5.2 47.51,56.31 v47.31,56.52 | 39.37,72.39 40.96,73.98 40.96,76.52 41.91,77.47 49.53,77.47 50.8,78.73 v50.8,82.55
  Top 0.406: X5.1 36.83,74.93 39.37,72.39 39.37,68.58 39.37,66.04 38.1,64.77 36.83,64.77 36.68,64.77 D1.2 | 36.66,65.09 D1.2 | C35.1 45.52,50.37 44.77,51.12 43.18,52.7 v43.18,53.34 | D1.2 36.51,64.45 38.1,62.87 38.1,53.34 v33.02,53.34 | R18.2 42.55,38.53 | 42.55,38.53 31.95,38.53 31.11,39.37 31.11,41.48 U5.8 32.05,41.57 32.07,41.59 32.38,41.91 32.38,43.5 | U5.6 30.49,42.87 30.48,42.86 30.48,43.5 31.19,43.5 U5.5 32.36,43.52 | U5.4 32.41,43.52 32.38,43.5 | 32.36,43.52 32.38,43.5 | U8.5 32.7,49.21 32.38,48.9 32.38,43.54 32.36,43.52 | R14.2 48.78,39.8 v48.9,39.69 | v42.55,37.78 42.55,38.53 | 20.32,44.45 20.64,44.77 21.59,44.77 21.91,44.45 21.91,43.81 21.91,43.87 U7.8 | 20.32,44.45 v20.32,44.77 | 20.32,44.45 C36.1
  Top 0.61: U10.2 65.08,54.33 C40.1 66.04,54.29 73.98,46.35 73.98,41.59 | 73.98,41.59 73.98,41.27 73.98,41.59
  Top 0.68: 35.56,50.8 R36.2 35.36,49.21 U8.5
  Top 0.7: 73.98,41.59 73.98,41.27 73.98,39.38 C42.P$1
  Top 0.813: 65.08,54.33 65.08,52.38 64.77,52.07 62.23,52.07 v55.88,52.07 | v43.18,53.34 38.1,53.34 35.56,50.8 | C42.P$1 73.99,34.07 74.03,34.03 L6.1
  Bottom 0.305: v47.31,56.52 47.31,54.61 | v50.8,82.55 57.15,82.55 58.42,81.28 X8.4
  Bottom 0.406: v48.9,39.69 43.18,39.69 42.55,39.05 v42.55,37.78 | v20.32,44.77 20.32,52.07 21.59,53.34 v33.02,53.34
  Bottom 0.813: v55.88,52.07 53.34,54.61 47.31,54.61 44.45,54.61 v43.18,53.34
3.3VOBC
  Top 0.7: X2.46 82.91,21.87 82.87,21.91 82.83,21.87 X2.45
ADC0  (via drill 0.3)
  Top 0.305: U6.8 46.03,45.08 43.81,42.86 37.47,42.86 37.15,43.18 v35.88,43.18 | v25.87,43.18 25.4,42.86 23.5,42.86 23.18,43.18 23.18,43.81 23.18,43.82 U7.6 23.18,44.45 22.54,44.45 22.54,44.44 U7.7
  Bottom 0.305: v35.88,43.18 v25.87,43.18
ADC1  (via drill 0.3)
  Top 0.305: U6.9 46.34,44.43 44.13,42.23 v36.67,42.23 | v26.67,42.23 22.86,42.23 22.54,41.91 U7.2 22.54,41.19 22.54,40.64 21.91,40.64 21.89,40.66 U7.1
  Bottom 0.305: v36.67,42.23 v26.67,42.23
BEACON_-FAULT  (via drill 0.3)
  Top 0.406: U9.8 66.67,64.14 66.04,63.5 66.04,59.69 68.58,57.15 v68.58,55.88 | v71.12,55.88 71.12,54.61 79.69,46.04 82.55,46.04 83.5,46.04 83.98,45.56 83.98,43.48 X2.30
  Bottom 0.406: v68.58,55.88 v71.12,55.88
BEACON_CE
  Top 0.305: U4.14 47.88,22.61 46.67,23.81 46.67,29.53 50.16,33.02 54.93,33.02 59.37,28.57 64.77,28.57 65.04,28.84 65.09,28.89 65.09,40.96 64.14,41.91 60.96,41.91 R22.2
BEACON_CWCONTROL
  Top 0.406: X5.2 34.31,71.25 R12.2 34.29,71.12 R11.1
BEACON_DATA
  Top 0.305: U4.4 55.6,18.06 61.59,12.06 62.23,11.43 69.85,11.43 73.34,14.92 73.34,22.86 69.22,26.99 68.94,27.26 68.94,42.82 68.94,47.9 67.31,49.53 R28.2
BEACON_MUXOUT
  Top 0.305: U4.6 56.2,19.36 62.87,12.7 69.22,12.7 72.07,15.56 72.07,22.23 67.94,26.35 67.64,26.66 67.64,42.22 67.64,45.39 66.04,46.99 R26.2
BEACON_OFF  (via drill 0.3)
  Top 0.406: C37.1 R35.2 64.14,73.14 U9.3 64.14,69.22 v64.77,68.58 | v76.83,66.04 76.83,53.98 79.69,51.12 83.5,51.12 84.81,49.81 X2.24
  Bottom 0.406: v64.77,68.58 66.36,68.58 67.31,67.63 67.94,66.99 67.94,66.36 68.26,66.04 v76.83,66.04
BEACON_RFOUT
  Top 0.61: C2.1 34.92,19.05 | 34.92,19.05 L3.2 | C13.2 34.92,19.05
BEACON_SCL  (via drill 0.4)
  Top 0.305: R14.1 R13.1 46.79,38.3 46.99,38.1 47.31,38.1
  Top 0.406: 47.31,38.1 47.94,37.47 48.58,36.83 60.96,36.83 61.59,37.47 v61.59,39.69 | X2.37 82.77,32.07 82.87,32.07 84.14,33.34 85.41,33.34 86.04,33.34 87.63,31.75 88.27,31.11 X6.2
  Bottom 0.406: v61.59,39.69 63.82,39.69 65.72,41.59 80.33,41.59 81.28,40.64 81.28,33.48 X2.37
BEACON_SCLK
  Top 0.305: U4.11 55.31,22.61 55.88,23.18 57.15,24.45 59.37,26.67 66.67,26.67 66.83,26.83 | 66.83,26.83 66.99,26.99 | 66.99,26.99 66.99,41.91 66.99,44.45 65.72,45.72 R25.2 | 66.99,26.99 66.83,26.83
BEACON_SDA  (via drill 0.4)
  Top 0.305: R18.1 R16.1 45.09,36.83
  Top 0.406: 45.09,36.83 46.04,35.88 61.91,35.88 62.55,36.51 v62.55,38.73 | X2.39 82.83,29.49 84.14,30.8 86.04,30.8 87.63,29.21 88.27,28.57 X6.1
  Bottom 0.406: v62.55,38.73 64.45,38.73 66.36,40.64 79.06,40.64 80.33,39.37 80.33,37.47 80.33,32.22 82.55,29.84 82.55,29.67 X2.39
BEACON_SDATA
  Top 0.305: U4.12 55.01,23.26 55.24,23.5 59.05,27.3 66.04,27.3 66.34,27.6 66.36,27.62 66.36,40.01 66.36,43.18 65.09,44.45 R24.2
BEACON_SLE
  Top 0.305: U4.13 48.18,23.26 47.62,23.81 47.62,29.53 50.48,32.38 54.61,32.38 59.05,27.94 65.41,27.94 65.69,28.22 65.72,28.26 65.72,41.91 64.45,43.18 R23.2
BEACON_TXCLK
  Top 0.305: U4.5 55.9,18.71 61.91,12.7 62.55,12.06 69.53,12.06 72.71,15.24 72.71,22.54 68.58,26.67 68.29,26.96 68.29,42.52 68.29,46.65 66.67,48.26 R27.2
BEACON_WDT_RST
  Top 0.305: U8.3 30.16,47.31 29.53,46.67 29.53,42.86 30.16,42.23 U5.7
  Top 0.406: 30.16,47.31 29.73,47.31 C31.1
BUS_CS  (via drill 0.3)
  Top 0.406: R30.1 27.3,38.73 29.21,36.83 40.32,36.83 43.18,33.97 63.5,33.97 64.45,34.92 64.45,40.32 v63.82,40.96
  Bottom 0.406: v63.82,40.96 65.41,42.55 80.33,42.55 82.55,44.77 82.59,44.73 X2.27
GND  (via drill 0.3, 0.6, 0.8)
  Top 0.305: U4.19 47,19.36 46.04,20.32 43.81,20.32 | U1.5 30.48,20.05 | 30.48,20.05 U1.4 30.53,20.05 30.48,20 | U1.6 30.48,19.55 | 30.48,19.55 U1.3 | 31.25,18.55 U1.1 31.25,18.55 | 30.48,19.55 30.48,18.73 30.48,18.55 | 30.48,19.55 30.48,20 | U4.7 55.24,20.01 v55.56,20 | U4.22 47.57,17.41 46.35,16.19 46.04,15.88 46.04,13.02 | 31.25,18.55 31.61,18.55 | U1.8 29.34,18.55 | 29.34,18.55 29.21,18.41 | 29.21,18.41 28.89,18.1 28.89,16.19 | 31.25,18.55 30.48,18.55 | 30.48,18.55 29.34,18.55 | 29.34,18.55 29.21,18.41 | 30.48,20 30.48,20.05 | 30.48,20 30.48,19.55 | 46.15,51.75 C35.2 | U8.2 30.8,48.26 30.48,48.58 30.48,49.21 | U5.2 34.6,42.22 34.92,42.55 34.92,45.09
  Top 0.406: JP1.1 31.43,60.01 30.8,59.37 LED1.C | U6.4 45.35,47.68 43.81,49.21 | R32.2 46.15,51.75 | C35.2 46.15,51.87 v45.72,53.02 | C33.2 R29.2 | R17.2 C30.2 | U7.4 23.84,40.62 24.13,40.32 v25.08,40.32
  Top 0.68: 53.98,38.73 54.09,38.62 R2.1 56.4,38.42 TR1.2
  Top 0.813: F1.4 19.05,16.51 | F1.2 19.05,22.86
  Bottom 0.305: v45.72,53.02 46.35,52.7
  other vias: 60.97,21.75 52.7,10.16 53.98,10.16 56.52,10.16 48.9,11.75 46.99,11.75 55.24,10.16 47.94,11.75 69.85,16.51 69.85,17.78 69.85,19.05 69.85,20.32 64.77,22.86 66.04,22.86 67.31,22.86 68.58,22.86 69.85,21.59 69.85,22.86 50.8,30.48 49.53,29.21 50.8,29.21 45.09,31.11 42.55,31.11 40.01,31.11 37.47,31.11 34.92,31.11 32.38,31.11 29.84,31.11 27.3,31.11 24.77,31.11 22.23,31.11 19.68,31.11 17.14,31.11 14.61,31.11 12.06,31.11 9.53,31.11 6.99,31.11 4.45,31.11 1.91,31.11 1.91,28.57 1.91,26.04 1.91,23.5 1.91,20.95 1.91,18.41 1.91,15.88 1.91,13.34 4.45,13.34 6.99,13.34 9.53,13.34 12.06,13.34 13.34,12.06 13.34,9.53 13.34,6.99 13.34,4.45 13.34,1.91 15.88,1.91 18.41,1.91 20.95,1.91 23.5,1.91 26.04,1.91 28.57,1.91 31.11,1.91 33.66,1.91 36.2,1.91 38.73,1.91 41.27,1.91 43.81,1.91 46.35,1.91 48.9,1.91 51.44,1.91 53.98,1.91 56.52,1.91 59.05,1.91 61.59,1.91 64.14,1.91 66.67,1.91 69.22,1.91 71.75,1.91 74.3,1.91 76.83,1.91 79.38,1.91 79.38,4.45 79.38,6.99 79.38,9.53 79.38,12.06 79.38,14.61 79.38,17.14 79.38,19.68 79.38,22.23 79.38,24.77 79.38,27.3 79.38,29.84 45.09,28.57 45.09,26.04 42.55,23.5 40.01,23.5 37.47,23.5 34.92,23.5 32.38,22.23 29.84,22.23 27.3,22.23 24.77,22.23 22.23,22.23 19.68,22.23 17.14,22.23 14.61,22.23 14.61,15.88 17.14,15.88 19.68,15.88 22.23,15.88 23.5,14.61 23.5,12.06 24.13,7.62 26.04,6.03 28.57,4.45 31.11,4.45 33.66,4.45 36.2,4.45 38.73,4.45 41.27,4.45 43.81,4.45 46.35,4.45 48.9,4.45 51.44,4.45 53.98,4.45 56.52,4.45 59.05,4.45 61.59,4.45 64.14,4.45 66.67,4.45 69.22,4.45 71.75,6.99 74.3,9.53 76.83,12.06 29.84,15.88 32.38,15.88 34.92,15.88 37.47,15.88 40.01,15.88 29.84,13.34 29.84,10.79 32.38,8.26 34.92,8.26 37.47,8.26 40.01,8.26 42.55,8.26 45.09,8.26 47.62,8.26 50.16,8.26 41.91,15.24 41.91,12.7 41.91,10.16 43.18,21.59 68.58,67.94 68.58,69.22 69.53,69.22 69.53,67.94 68.58,63.5 69.85,63.5 68.58,62.23 69.85,62.23 70.48,34.92 71.75,34.92 70.48,36.2 71.75,36.2 70.48,31.11 71.75,31.11 70.48,29.84 71.75,29.84 60.96,69.85 60.96,68.58 59.69,68.58 59.69,69.85 60.96,71.12 59.69,71.12 59.69,58.42 60.96,58.42 59.69,57.15 60.96,57.15 38.1,45.72 38.1,46.99 38.1,48.26 39.37,49.53 54.29,38.73 51.75,38.73 40.64,49.53 41.91,49.53 43.18,49.53 33.02,64.77 38.1,68.58 30.48,50.16 29.21,50.16 33.66,45.09 64.14,31.11 61.59,31.11 59.05,31.11 19.68,38.73 20.95,38.73 20.95,37.47 19.68,37.47 18.41,37.47 18.41,38.73 53.34,30.48 53.34,29.21 5.08,74.93 6.35,74.93 7.62,74.93 8.89,74.93 10.16,74.93
  pour Bottom (isolate 0.406): 0,31.75 0,12.7 12.7,12.7 12.7,0 80.01,0 80.01,30.75 79.01,31.75
  pour Top (no thermals): 67.31,13.97 67.31,17.14 68.58,17.14 68.58,19.68 67.31,19.68 67.31,21.91 63.5,21.91 63.5,21.27 59.37,21.27 59.37,25.08 60.01,25.72 67.31,25.72 70.8,22.23 70.8,15.88 68.9,13.97
  pour Top (no thermals): 52.07,11.43 57.47,11.43 57.78,11.75 57.78,13.97 58.74,13.97 61.59,11.11 61.59,10.16 61.28,9.84 52.39,9.84 52.07,10.16
  pour Top (no thermals): 45.72,11.11 45.72,15.56 46.04,16.19 46.35,16.19 46.35,13.34 50.48,13.34 50.48,11.43 50.16,11.11
  pour Top (no thermals): 48.9,27.94 51.12,27.94 51.12,30.16 53.02,30.16 53.02,25.4 51.75,25.4 51.75,24.45 52.07,24.13 54.93,24.13 58.1,27.3 58.1,27.94 54.29,31.75 50.8,31.75 48.9,29.84
  pour Top (no thermals): 0,31.75 47.94,31.75 45.72,29.53 45.72,24.45 43.81,24.45 43.81,20.32 42.55,20.32 41.59,21.91 34.29,21.91 34.29,21.27 6.67,21.27 6.67,16.83 25.4,16.83 25.4,7.62 27.94,5.08 69.22,5.08 77.47,13.34 77.47,31.75 79.33,31.75 80.33,30.75 80.33,0 12.7,0 12.7,12.7 0,12.7
  pour Top (no thermals): 28.89,16.83 43.18,16.83 43.18,9.21 50.48,9.21 51.75,7.94 51.75,7.62 30.8,7.62 28.26,10.16 28.26,15.56 28.89,16.19
  pour Top (no thermals): 71.75,75.56 71.75,68.26 70.48,68.26 70.48,66.36 68.9,66.36 68.9,64.14 72.07,64.14 72.07,62.23 70.17,60.33 67.63,60.33 66.99,60.96 66.99,62.87 67.94,63.82 67.94,69.85 69.53,69.85 69.53,75.56
  pour Bottom (isolate 0.406, no thermals): 0,91.44 0,34.29 81.28,34.29 91.44,34.29 91.44,91.44
  pour Top (no thermals): 62.55,75.56 62.55,72.07 63.18,72.07 63.18,68.26 61.59,68.26 61.59,66.36 60.01,66.36 60.01,64.14 62.87,64.14 62.87,57.15 63.5,57.15 63.5,55.88 59.69,55.88 59.69,54.29 59.37,53.98 58.42,53.98 58.42,75.56
  pour Top (no thermals): 72.39,26.04 72.39,43.5 69.53,43.5 69.53,27.62 71.12,26.04
  pour Top (no thermals): 39.69,44.77 39.69,48.58 40.32,49.21 43.81,49.21 43.81,49.53 41.59,51.75 38.73,51.75 37.15,50.16 37.15,45.09 37.78,44.45 39.37,44.45
  pour Top: 50.8,39.37 50.8,38.1 54.93,38.1 54.93,39.37
  pour Top (no thermals): 34.92,65.72 31.75,65.72 31.75,63.5 34.92,63.5
  pour Top (no thermals): 37.47,71.75 37.47,67.94 38.73,67.94 38.73,71.75
  pour Top (no thermals): 31.11,48.9 31.11,51.12 27.94,51.12 27.94,48.9
  pour Top (no thermals): 34.92,44.45 33.02,44.45 33.02,45.4 34.92,45.4
  pour Top (no thermals): 57.15,31.75 59.69,29.21 64.77,29.21 64.77,31.75
  pour Top (no thermals): 22.54,34.29 22.54,39.37 20.95,39.37 20.95,41.91 19.37,41.91 19.37,45.72 22.54,45.72 22.54,51.12 17.14,51.12 17.14,34.29
  pour Top (no thermals): 24.45,40.96 24.45,39.69 26.35,39.69 26.35,40.96
  pour Bottom (isolate 0.406, no thermals): 81.6,15.24 81.6,13.02 92.08,13.02 92.08,35.56 85.41,35.56 85.41,15.24
  pour Top (no thermals): 3.81,77.47 3.81,73.66 11.43,73.66 11.43,77.47
  pour Top (no thermals): 28.89,18.1 28.89,16.51 29.84,16.51 29.84,18.1
  pour Top (no thermals): 81.92,78.74 81.92,76.83 87.95,76.83 87.95,74.61 89.85,74.61 89.85,78.74
N$1  (via drill 0.3)
  Top 0.305: U6.11 46.94,43.13 43.81,40.01
  Top 0.406: R15.1 29.41,54.18 26.99,51.75 26.99,47.94 28.57,46.35 28.57,41.27 v29.84,40.01 | v32.07,40.01 43.81,40.01
  Bottom 0.406: v29.84,40.01 v32.07,40.01
N$2  (via drill 0.3)
  Top 0.305: U6.27 55.33,48.98 55.56,49.21 55.56,50.16 54.29,51.44 | 54.29,51.44 54.29,68.9 | 54.29,51.44 54.29,68.9 | 54.29,51.44 54.29,68.9 | 54.29,51.44 54.29,68.9 | 54.29,68.9 54.29,72.71 59.05,77.47 60.96,77.47 62.87,79.38 62.87,84.45 v62.23,85.09
  Bottom 0.305: v62.23,85.09 61.28,84.14 58.74,84.14 58.42,84.45 X8.3
N$3
  Top 0.305: U6.26 53.27,48.33 53.02,48.58 53.02,68.9 53.02,82.87 53.34,83.19 56.2,83.19 57.15,84.14 X8.5
N$4
  Top 0.305: U6.25 52.65,47.68 52.39,47.94 52.39,68.9 52.39,83.19 53.02,83.82 55.24,83.82 55.88,84.45 X8.7
N$5
  Top 0.305: U6.5 45.04,47.03 44.45,47.62 44.15,47.92 Q1.2 42.84,47.94 C34.1
N$6
  Top 0.305: U6.6 45.11,46.38 44.45,45.72 44.15,45.42 Q1.1 42.84,45.4 C32.1
N$7
  Top 0.406: JP1.2 31.32,57.47 LED1.A R15.2
N$8
  Top 0.305: U6.28 54.33,50.13 53.66,50.8 53.66,68.9 53.66,73.34 55.24,74.93 58.74,78.42 60.64,78.42 61.91,79.69 61.91,84.14 61.28,84.77 60.01,84.77 X8.1
N$9
  Top 0.305: U6.12 47.56,42.48 45.09,40.01 R16.2 | R16.2 45.09,38.42 R16.2
N$10
  Top 0.305: U6.13 47.86,41.83 47.62,41.59 46.35,40.32 R13.2
N$11  (via drill 0.3)
  Top 0.305: U6.16 52.15,41.83 51.75,42.23 51.75,61.28 51.44,61.59 v51.44,62.55 | v43.18,68.58 R20.2
  Bottom 0.305: v51.44,62.55 49.21,62.55 v43.18,68.58
N$12
  Top 0.305: U6.10 46.64,43.78 44.77,41.91 44.45,41.59 38.1,41.59 37.78,41.27 35.88,41.27 35.56,41.59 33.58,41.59 U5.1
N$13  (via drill 0.3)
  Top 0.305: U6.14 49.75,41.18 50.48,41.91 50.48,58.74 49.53,59.69 v49.53,60.96 | v38.1,67.31 35.56,67.31
  Top 0.406: C29.1 35.56,69.85 | 35.56,69.85 34.41,69.85 R12.1 | D1.3 35.56,67.31 35.56,69.85
  Bottom 0.305: v49.53,60.96 43.18,67.31 v38.1,67.31
N$14
  Top 0.305: U4.16 45.37,21.31 45.09,21.59 L4.1 | L4.1 45.09,22.23 L4.1
N$15
  Top 0.305: L4.2 45.6,23.61 46.99,22.23 47.26,21.96 U4.15
N$16  (via drill 0.3)
  Top 0.305: U4.24 48.52,15.3 C23.2 v51.44,14.92
  Bottom 0.305: C25.1 v51.44,14.92
N$17  (via drill 0.3)
  Top 0.305: U4.17 47.49,20.66 v47.15,20.48
  Bottom 0.305: v47.15,20.48 47.43,20.64 47.74,20.64 50.8,20.64 51.44,20 C25.2
N$18
  Top 0.305: U4.23 47.88,16.76 47.31,16.19 R8.2 | R8.2 47.31,14.61 R8.2
N$19  (via drill 0.3)
  Top 0.305: TR1.3 59.69,39.69 59.69,40.32 59.69,50.48 60.01,50.8
  Top 0.406: R4.1 72.82,74.84 C9.1 73.03,73.46 U2.3 73.03,69.22 73.34,68.9 77.15,68.9 77.79,68.26 v77.79,61.28 | 60.01,50.8 65.72,50.8 v66.67,51.75 | v72.39,54.61 72.39,58.1 v75.56,61.28
  Bottom 0.406: v66.67,51.75 69.53,51.75 v72.39,54.61 | v75.56,61.28 v77.79,61.28
N$20
  Top 0.305: C27.1 R9.1
N$21
  Top 0.406: R3.2 71.06,65.29 U2.5
N$22
  Top 0.406: R17.1 R21.2 | C30.1 R17.1 | U7.5 23.84,46.13 R17.1
N$23
  Top 0.305: U4.20 46.33,18.71
  Top 0.61: C14.2 44.45,19.05 L5.P$2 44.66,18.71 46.33,18.71
  pour Top (no thermals): 45.4,19.37 46.04,19.37 46.67,18.73 46.52,18.58 45.4,18.58
N$24
  Top 0.254: 49.41,26.12 49.44,25.8 49.53,26.35
  Top 0.305: U4.18 49.85,20.01 50.16,20.32 50.16,23.18 49.85,23.5 49.41,23.93 R10.1 49.41,26.12 C28.1
  Top 0.406: R10.1 48.58,24.77
N$25
  Top 0.305: U4.2 55.31,16.76
  Top 0.406: 55.31,16.76 56.52,15.56 56.52,13.65 C17.2
N$26
  Top 0.305: C27.2 C26.2 50.91,26.12 R10.2 50.91,24.02 52.7,22.23 52.7,17.78 53.02,17.46 53.08,17.41 U4.3
N$27
  Top 0.305: U4.21 46.95,18.06 45.72,16.83 44.64,16.83 L5.P$1
  Top 0.61: L5.P$1 44.56,16.64 C18.1 C19.1 44.56,12.81 R6.2
N$28
  Top 0.305: U1.2 C2.2
N$29
  Top 0.61: C11.2 40.01,19.05 C14.1 L2.1
N$30
  Top 0.305: U1.7 27.11,19.05 L1.P$2
  Top 0.61: C3.1 26.67,19.05 L1.P$2
N$31
  Top 0.305: X8.10 R31.1
N$32
  Top 0.406: R34.2 62.17,65.29 U9.5
N$33
  Top 0.406: R29.1 24.45,38.73 R30.2 | C33.1 R29.1 | U7.3 23.18,40.31 23.5,40.01 23.5,38.85 R29.1
N$34
  Top 0.61: C3.2 F1.1
N$35
  Top 0.61: F1.3 C4.1
N$36
  Top 0.61: L3.1 37.47,19.05 | 37.47,19.05 L2.2 | C12.2 37.47,19.05
N$37
  Top 0.61: C4.2 X4.1
N$38
  Top 0.254: R7.2 61.66,22.86 62.1,22.42 62.1,20.16 | 60.64,19.05 61.63,19.05 62.1,19.52 62.1,20.16 | 62.1,20.16 62.1,20.3 C16.2
  Top 0.305: U3.2 60.96,20.95 61.48,20.95 | 61.48,20.95 arc-90 C16.2 62.12,20.2 | C21.1 60.64,19.05 | R7.2 60.01,22.86 | 61.91,20.95 61.48,20.95
  Top 0.406: 62.1,20.16 62.12,20.16 C16.2
N$39  (via drill 0.3)
  Top 0.305: U6.15 51.85,41.18 51.12,41.91 51.12,60.96 50.48,61.59 v50.48,63.82 | v45.72,68.58 R19.2
  Bottom 0.305: v50.48,63.82 49.21,63.82 45.72,67.31 v45.72,68.58
N$40
  Top 0.813: C40.2 60.64,54.29 R33.1
N$41
  Top 0.305: U6.24 55.29,47.03 57.78,49.53 R28.1
N$42
  Top 0.305: U6.23 55.91,46.38 57.78,48.26 R27.1
N$43
  Top 0.305: U6.22 56.53,45.73 57.78,46.99 R26.1
N$44
  Top 0.305: U6.21 57.15,45.08 57.78,45.72 R25.1
N$45
  Top 0.305: U6.20 58.92,44.43 R24.1
N$46
  Top 0.305: U6.19 57.18,43.78 57.78,43.18 R23.1
N$47
  Top 0.305: U6.18 56.56,43.13 57.78,41.91 R22.1
N$48
  cutout Bottom (no thermals): 4,12 4,4 12,4 12,12
N$49
  cutout Bottom (no thermals): 80,12 80,4 88,4 88,12
N$50
  cutout Bottom (no thermals): 80,88 80,80 88,80 88,88
N$51
  cutout Bottom (no thermals): 4,88 4,80 12,80 12,88
N$58
  Top 0.254: 1.59,81.44 1.59,83.34
N$59
  Top 0.254: 1.59,83.5 2.7,83.5 3.17,84.45 | 1.59,83.5 0.48,83.5 0.95,84.45 | 1.59,83.5 2.06,84.45
N$69
  Top 0.305: C16.1 65.13,20.32 TCXO1.3
N$666
  Top 0.61: U9.6 64.25,65.86 64.25,64.14 C38.1 64.25,61.36 C39.1 64.17,58.91 U10.3
  Top 0.68: U9.7 65.41,64.14 64.25,64.14
OSC1
  Top 0.305: U4.8 55.86,20.66 56.04,20.64 57.63,19.05 C21.2
OSC2
  Top 0.254: U3.4 56.53,21.61 56.36,21.59 56.08,21.31 U4.9
  Top 0.305: R7.1 58.3,21.7 U3.4
PA_-FAULT  (via drill 0.3)
  Top 0.305: U6.3 49.28,48.33 49.85,48.9 49.85,53.66 49.85,55.24 | 49.85,55.24 49.85,58.1 48.58,59.37 48.58,64.45 v49.21,65.09 | R5.1 49.85,55.24 | v75.56,63.18 U2.8 | U2.8 75.56,66.04 U2.8
  Bottom 0.305: v75.56,63.18 73.66,65.09 v49.21,65.09
PA_ON
  Top 0.305: U6.17 55.31,42.48 56.2,41.59 R2.2 57.44,40.12 TR1.1
RESETBEACON  (via drill 0.3)
  Top 0.254: 34.92,46.35 35.56,46.99
  Top 0.305: U6.7 45.73,45.73 43.81,43.81 37.47,43.81 34.92,46.35 | 34.92,46.35 34.77,46.51 | 34.77,46.51 34.92,46.35 | U8.4 35.36,47.31 R36.1 35.56,46.99 | R31.2 54.61,75.88 v53.98,75.25 | v50.8,71.12 50.8,67.94 50.48,67.63 48.26,67.63 47.31,66.67 47.31,58.42 46.99,58.1 46.35,58.1 45.72,57.47 45.72,55.56 45.09,54.93 v39.05,54.93 | v34.61,46.67 34.77,46.51
  Bottom 0.305: v53.98,75.25 53.98,74.3 v50.8,71.12 | v39.05,54.93 38.73,54.93 34.61,50.8 v34.61,46.67
RXD
  Top 0.406: X7.3 R20.1
STRUT_GND
  Top 1.016: C1.1 6.35,81.92 | R1.P$2 8.89,82.23
  pour Top (no thermals): 3.81,88.27 3.81,80.01 49.53,80.01 49.53,86.36 12.06,86.36 12.06,88.27
TEST  (via drill 0.3)
  Top 0.305: U6.1 47.84,49.63 47.62,49.85 47.62,50.16 47.94,50.48 48.58,50.48 48.9,50.8 48.9,51.64 R32.1 49.01,52.91 48.26,53.66 46.67,53.66 46.35,53.98 46.35,57.15 46.67,57.47 47.62,57.47 47.94,57.78 47.94,66.36 48.58,66.99 51.27,66.99 51.59,67.31 v51.59,81.6
  Bottom 0.305: v51.59,81.6 55.56,81.6 55.88,81.28 X8.8
TXD
  Top 0.406: X7.2 R19.1
VBAT
  Top 0.7: X2.12 X2.11
VBEACON_PA
  Top 0.61: C8.P$1 26.98,9.53 C7.1 26.79,12.06 C6.1 C5.1 26.79,16.43 L1.P$1 26.99,16.83
  Top 0.68: C10.1 73.14,64.14 | 73.14,64.14 73.14,65.86 U2.6 | U2.7 74.3,64.14 73.14,64.14
  Top 1.016: C10.1 73.14,61.71 69.85,58.42 69.85,53.34 76.2,46.99 76.2,13.97 68.58,6.35 30.18,6.35 C8.P$1
VBUS  (via drill 0.3)
  Top 0.406: R4.2 74.93,74.93 74.93,77.15 | R21.1 26.99,46.35 27.62,45.72 27.62,39.69 29.53,37.78 40.64,37.78 43.5,34.92 62.23,34.92 62.55,34.92 63.5,35.88 63.5,40.01 v62.55,40.96
  Top 1.27: X2.7 79.41,70.13 79.38,76.2 78.11,77.15 77.79,77.15 74.93,77.15 68.58,77.15 65.72,74.61
  Bottom 0.406: v62.55,40.96 62.55,41.27 65.09,43.81 79.38,43.81 80.33,44.77 80.33,66.36 81.6,67.63 82.69,67.63 X2.9
  pour Top (no thermals): 81.28,71.12 89.85,71.12 89.85,66.67 81.28,66.67
  pour Top (no thermals): 73.98,71.12 73.98,77.47 75.56,77.47 76.52,77.15 76.52,71.12
  pour Top (no thermals): 65.09,71.12 65.09,74.61 68.26,77.47 68.58,77.47 68.58,71.12
VCCRF  (via drill 0.3, 0.6)
  Top 0.254: U3.5 57.48,20.3 v57.15,20.64 | v59.69,17.78 63.18,14.29 v64.45,14.29
  Top 0.305: U4.1 55.01,16.11 55.24,15.88 | TCXO1.4 65.33,15.21 C15.1
  Top 0.406: 55.24,15.88 55.24,14.09 C22.1
  Top 0.61: R6.1 44.56,11.31 C20.1 50.8,10.16 | C22.1 C24.1 52.19,12.81 51.44,12.06 51.44,10.79 50.8,10.16 | 74.3,24.13 74.3,20.95 74.3,18.41 74.3,14.29 70.17,10.16 | 70.17,10.16 68.9,8.89 52.07,8.89 50.8,10.16 | 70.17,10.16 v66.36,10.16 | v64.45,14.29 65.72,14.29 66.04,14.61 C15.1
  Top 0.7: 74.3,24.13 74.3,25.4 74.3,27.95 73.98,28.26 | 73.98,27.95 73.98,27.83 C43.1
  Top 0.813: L6.2 73.98,28.26 73.98,27.95 73.98,27.94
  Bottom 0.254: v57.15,20.64 58.74,20.64 59.05,20.32 59.05,18.41 v59.69,17.78
  Bottom 0.61: v66.36,10.16 66.36,12.38 v64.45,14.29
VSOLAR
  pour Top (no thermals): 81.92,75.88 81.92,72.07 86.04,72.07 86.04,75.88

### Text on the board
Top: SW | RXD | TXD | GND | GND | 144MHz/146MHz | CW Beacon | GODTX_2 | G.O.D.Sat | OSSI-1 | GND | VBUS | GND | P3.0 | GND | SCL | SDA
tStop: SW | RXD | TXD | GND | GND | 144MHz/146MHz | CW Beacon | GODTX_2 | G.O.D.Sat | OSSI-1 | GND | VBUS | GND | P3.0 | GND | SCL | SDA